# EAGLE schematic KVM Keyboard (EAGLE 9.6.2)
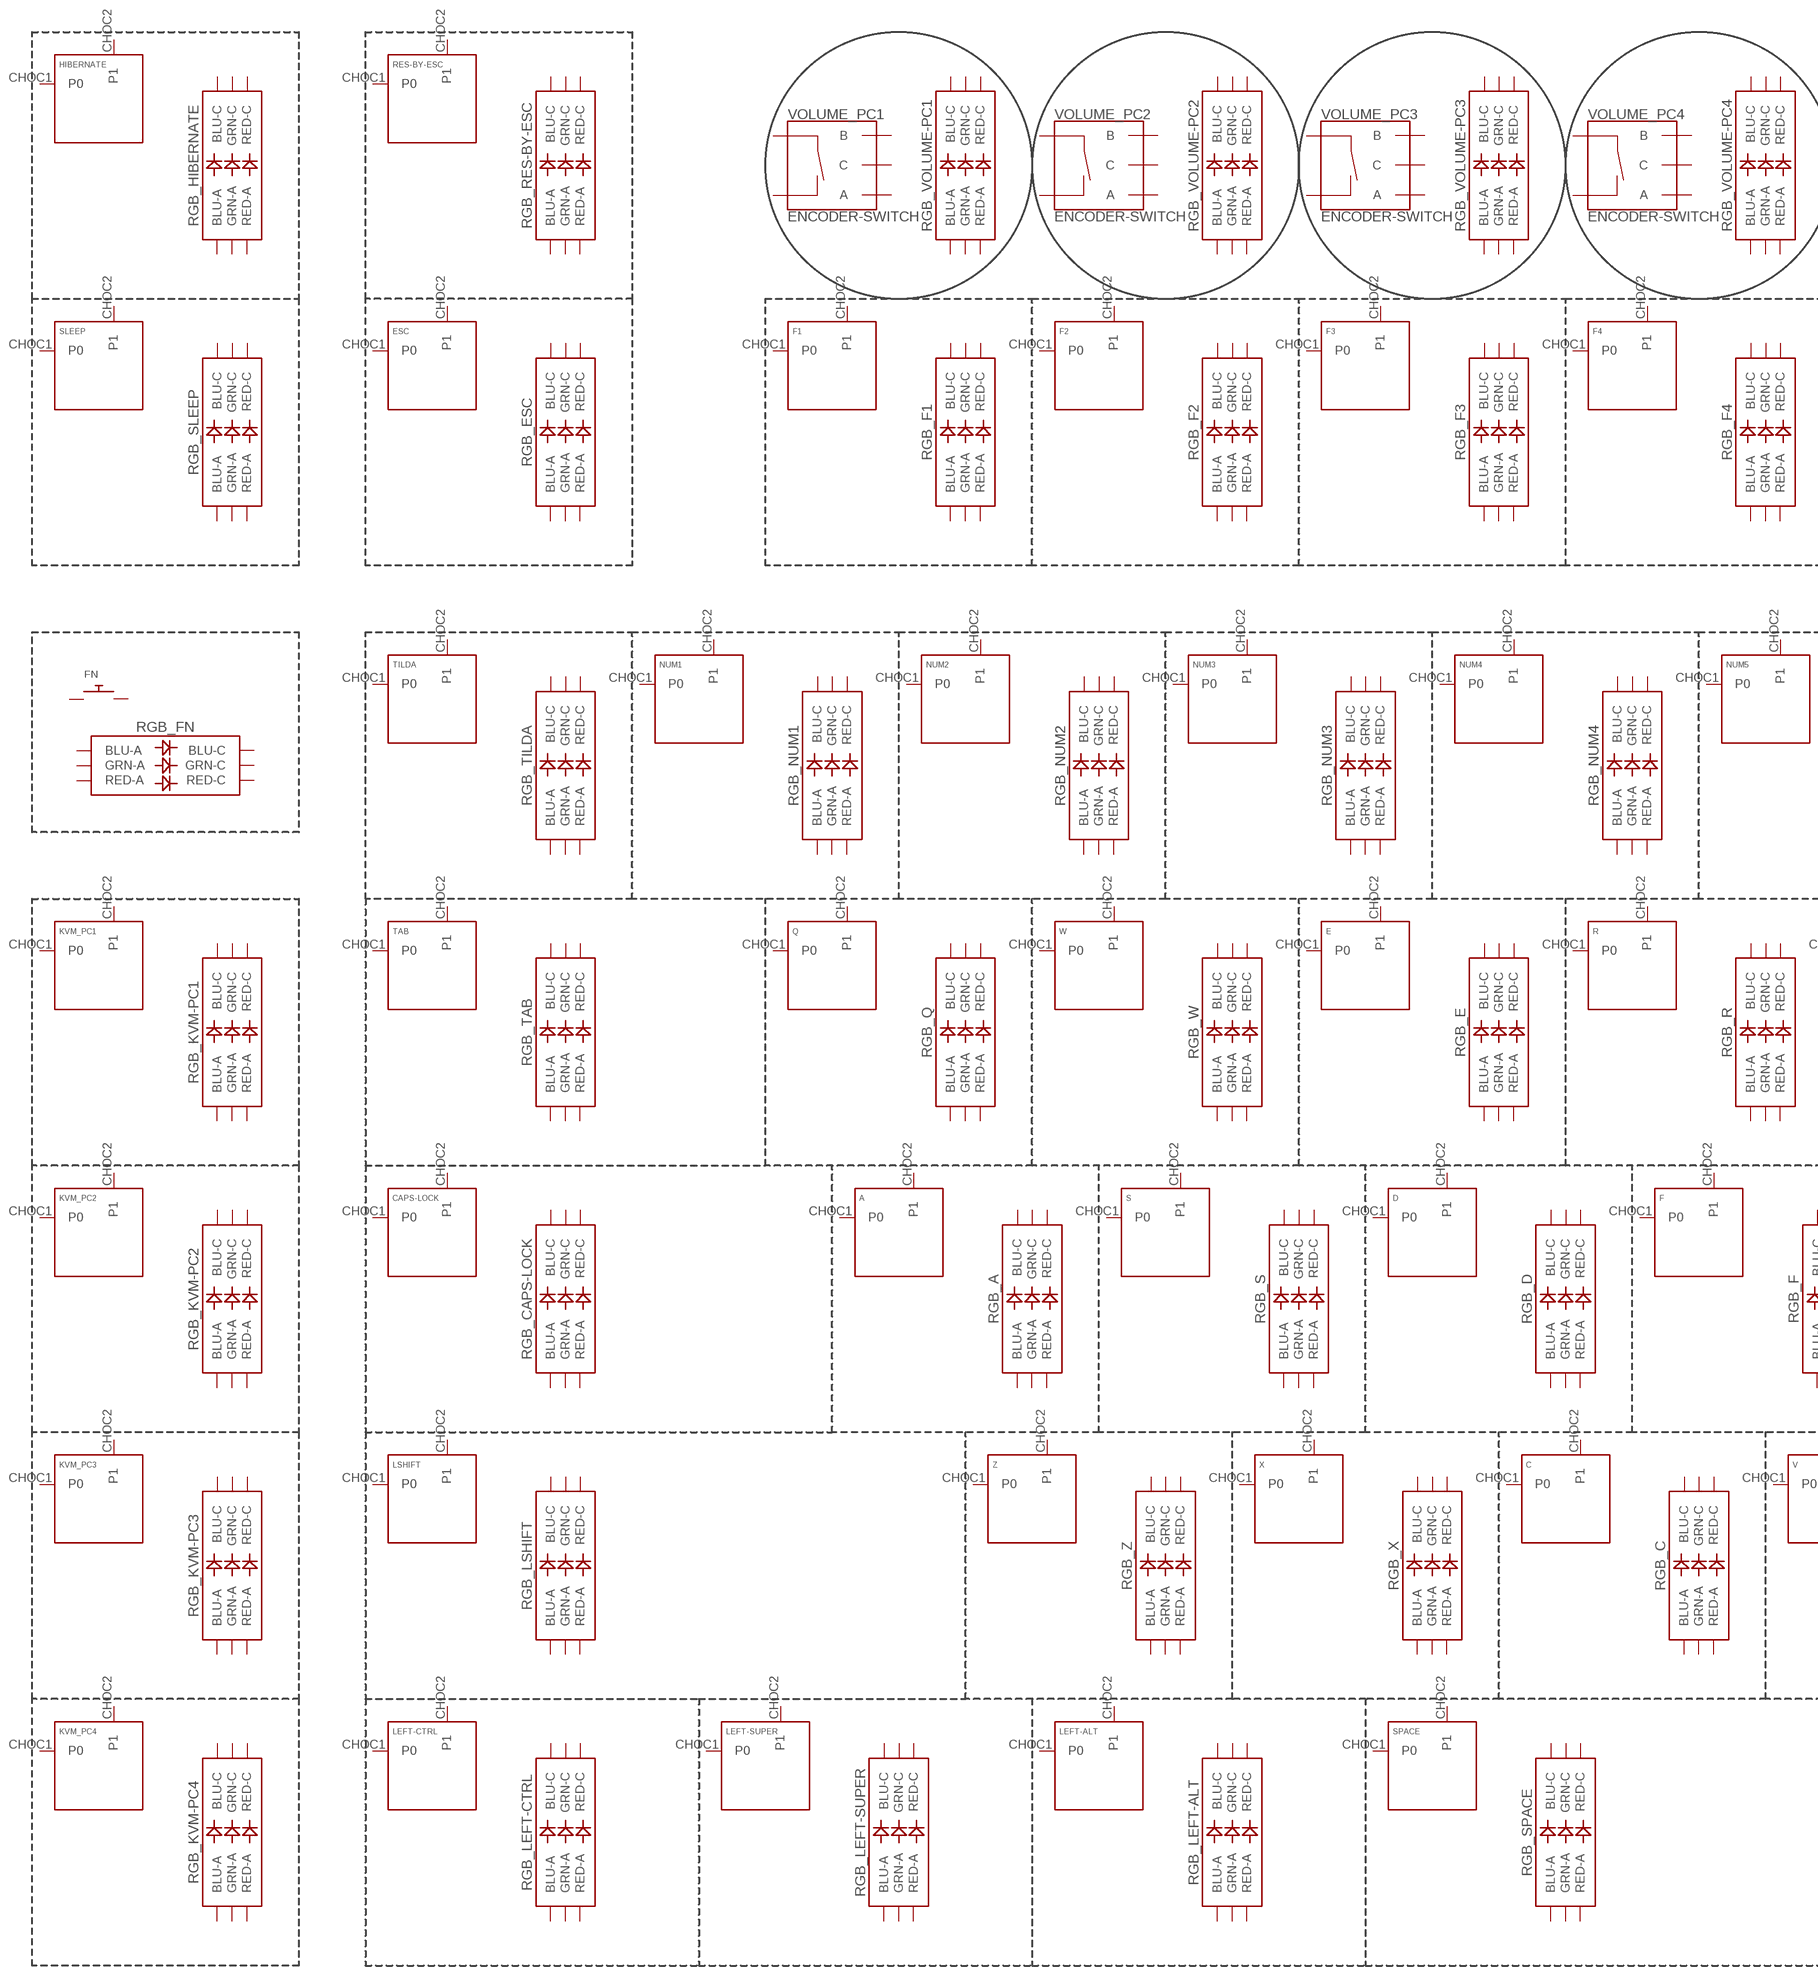
[diagram p0: schematic, sheet 1, part 1 of 3]
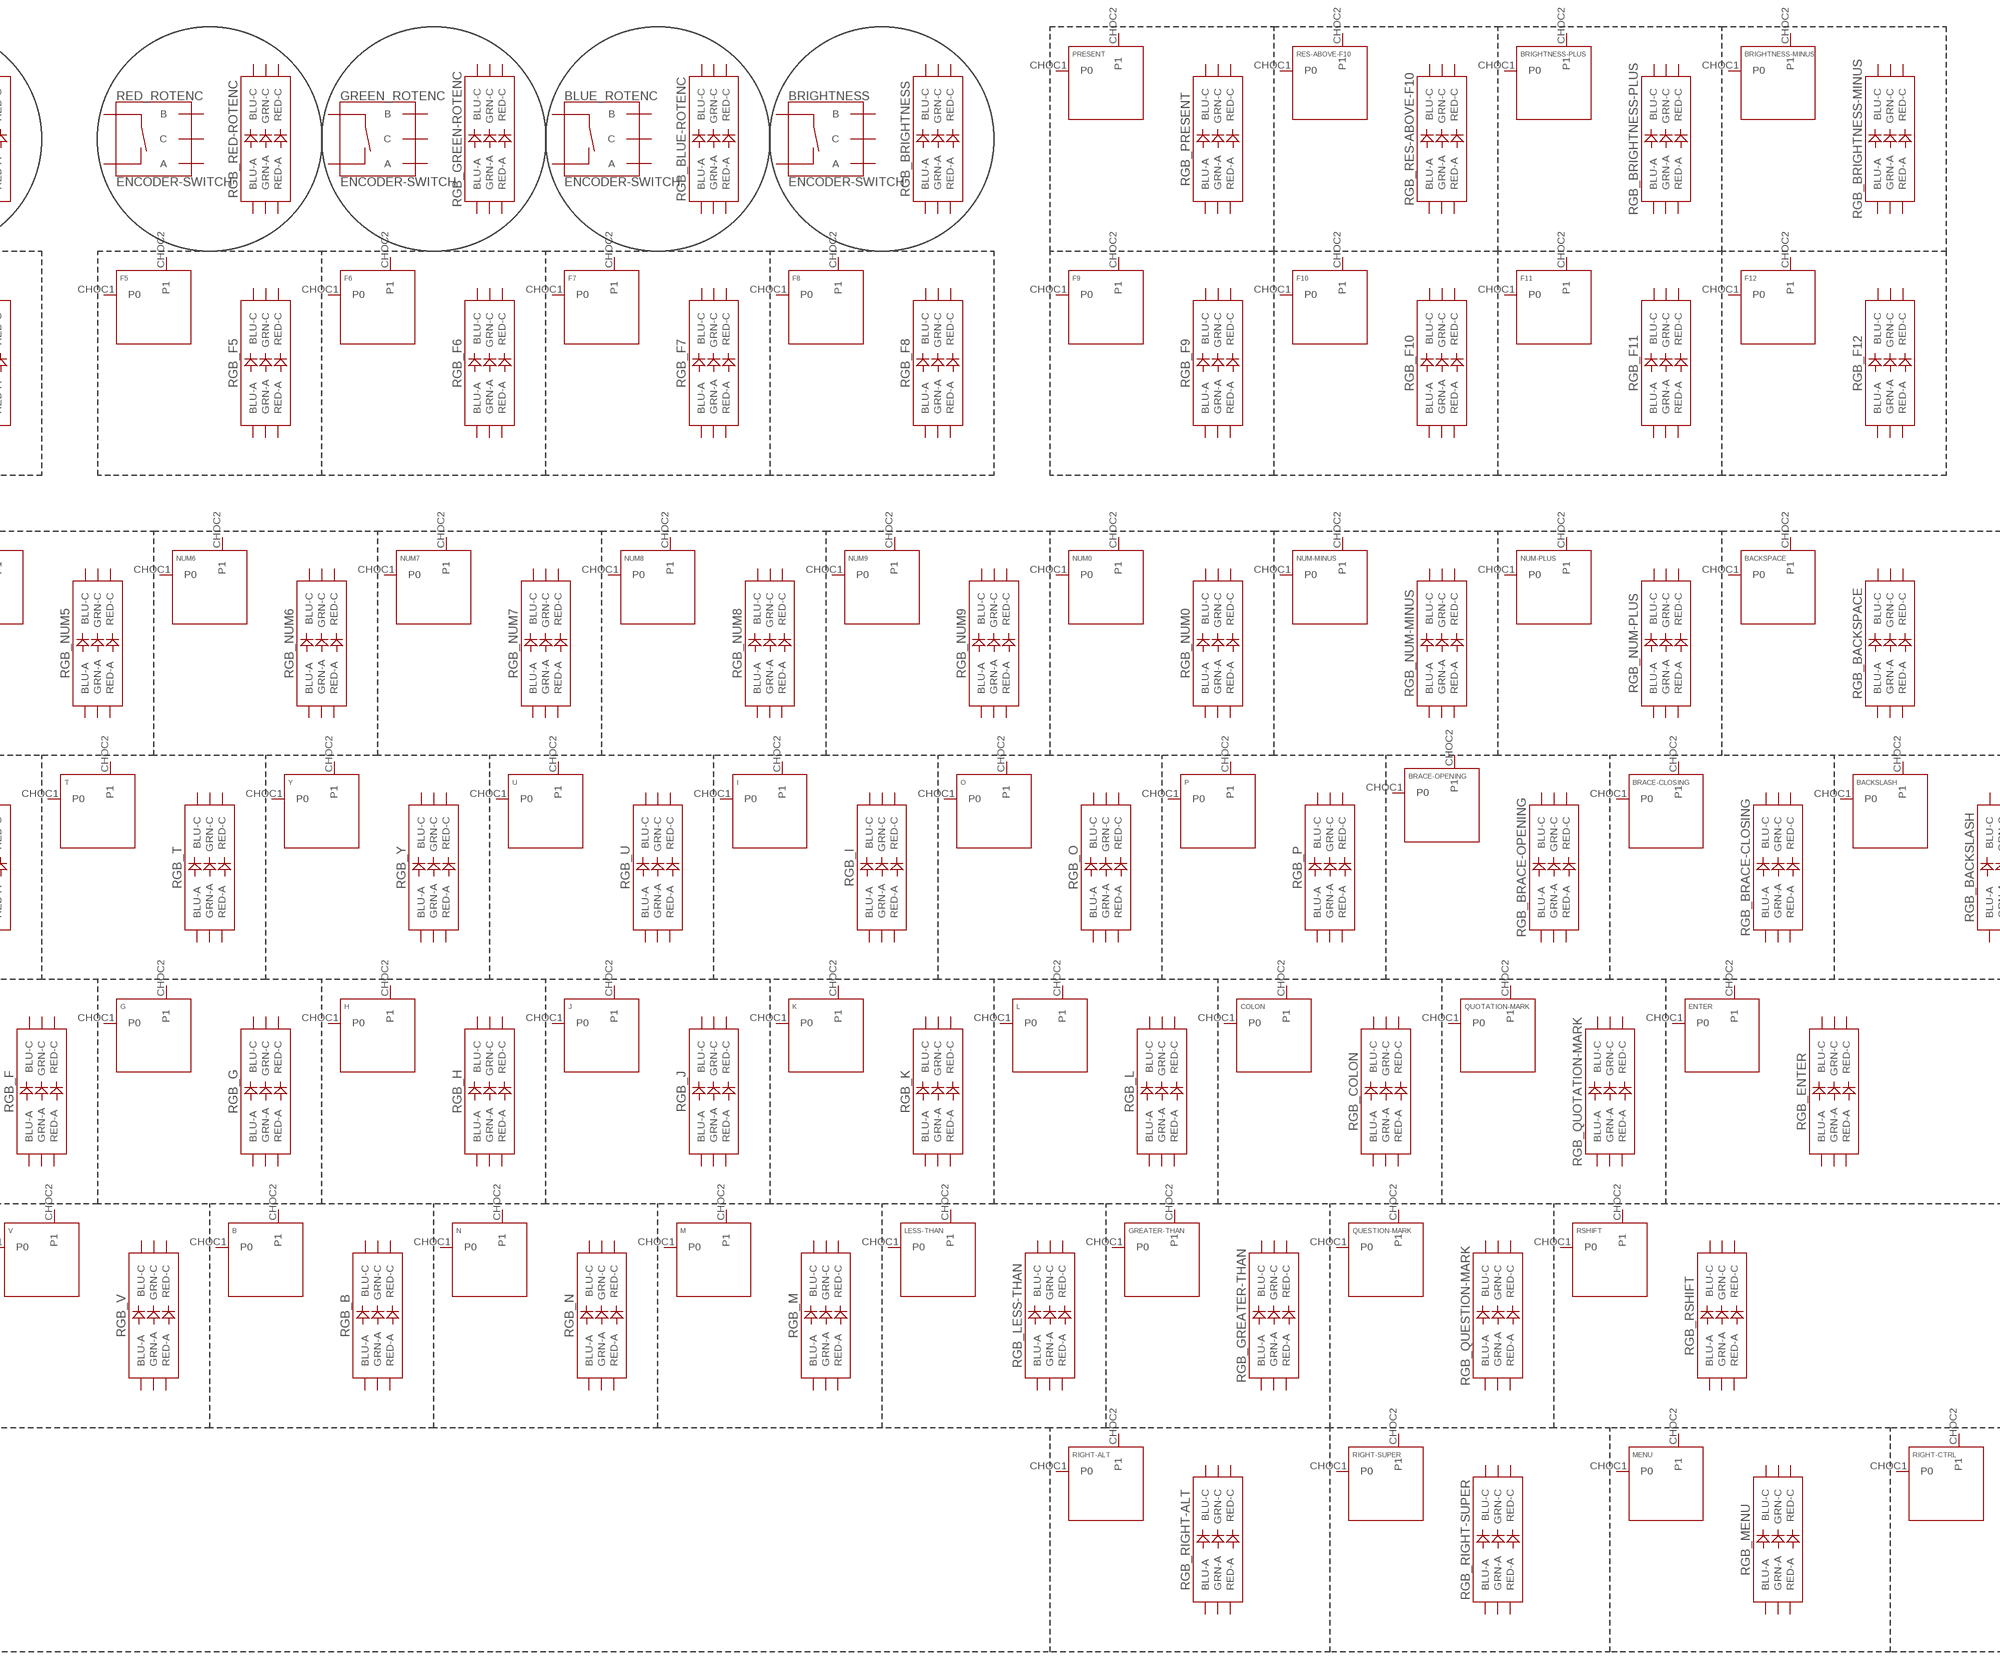
[diagram p1: schematic, sheet 1, part 2 of 3]
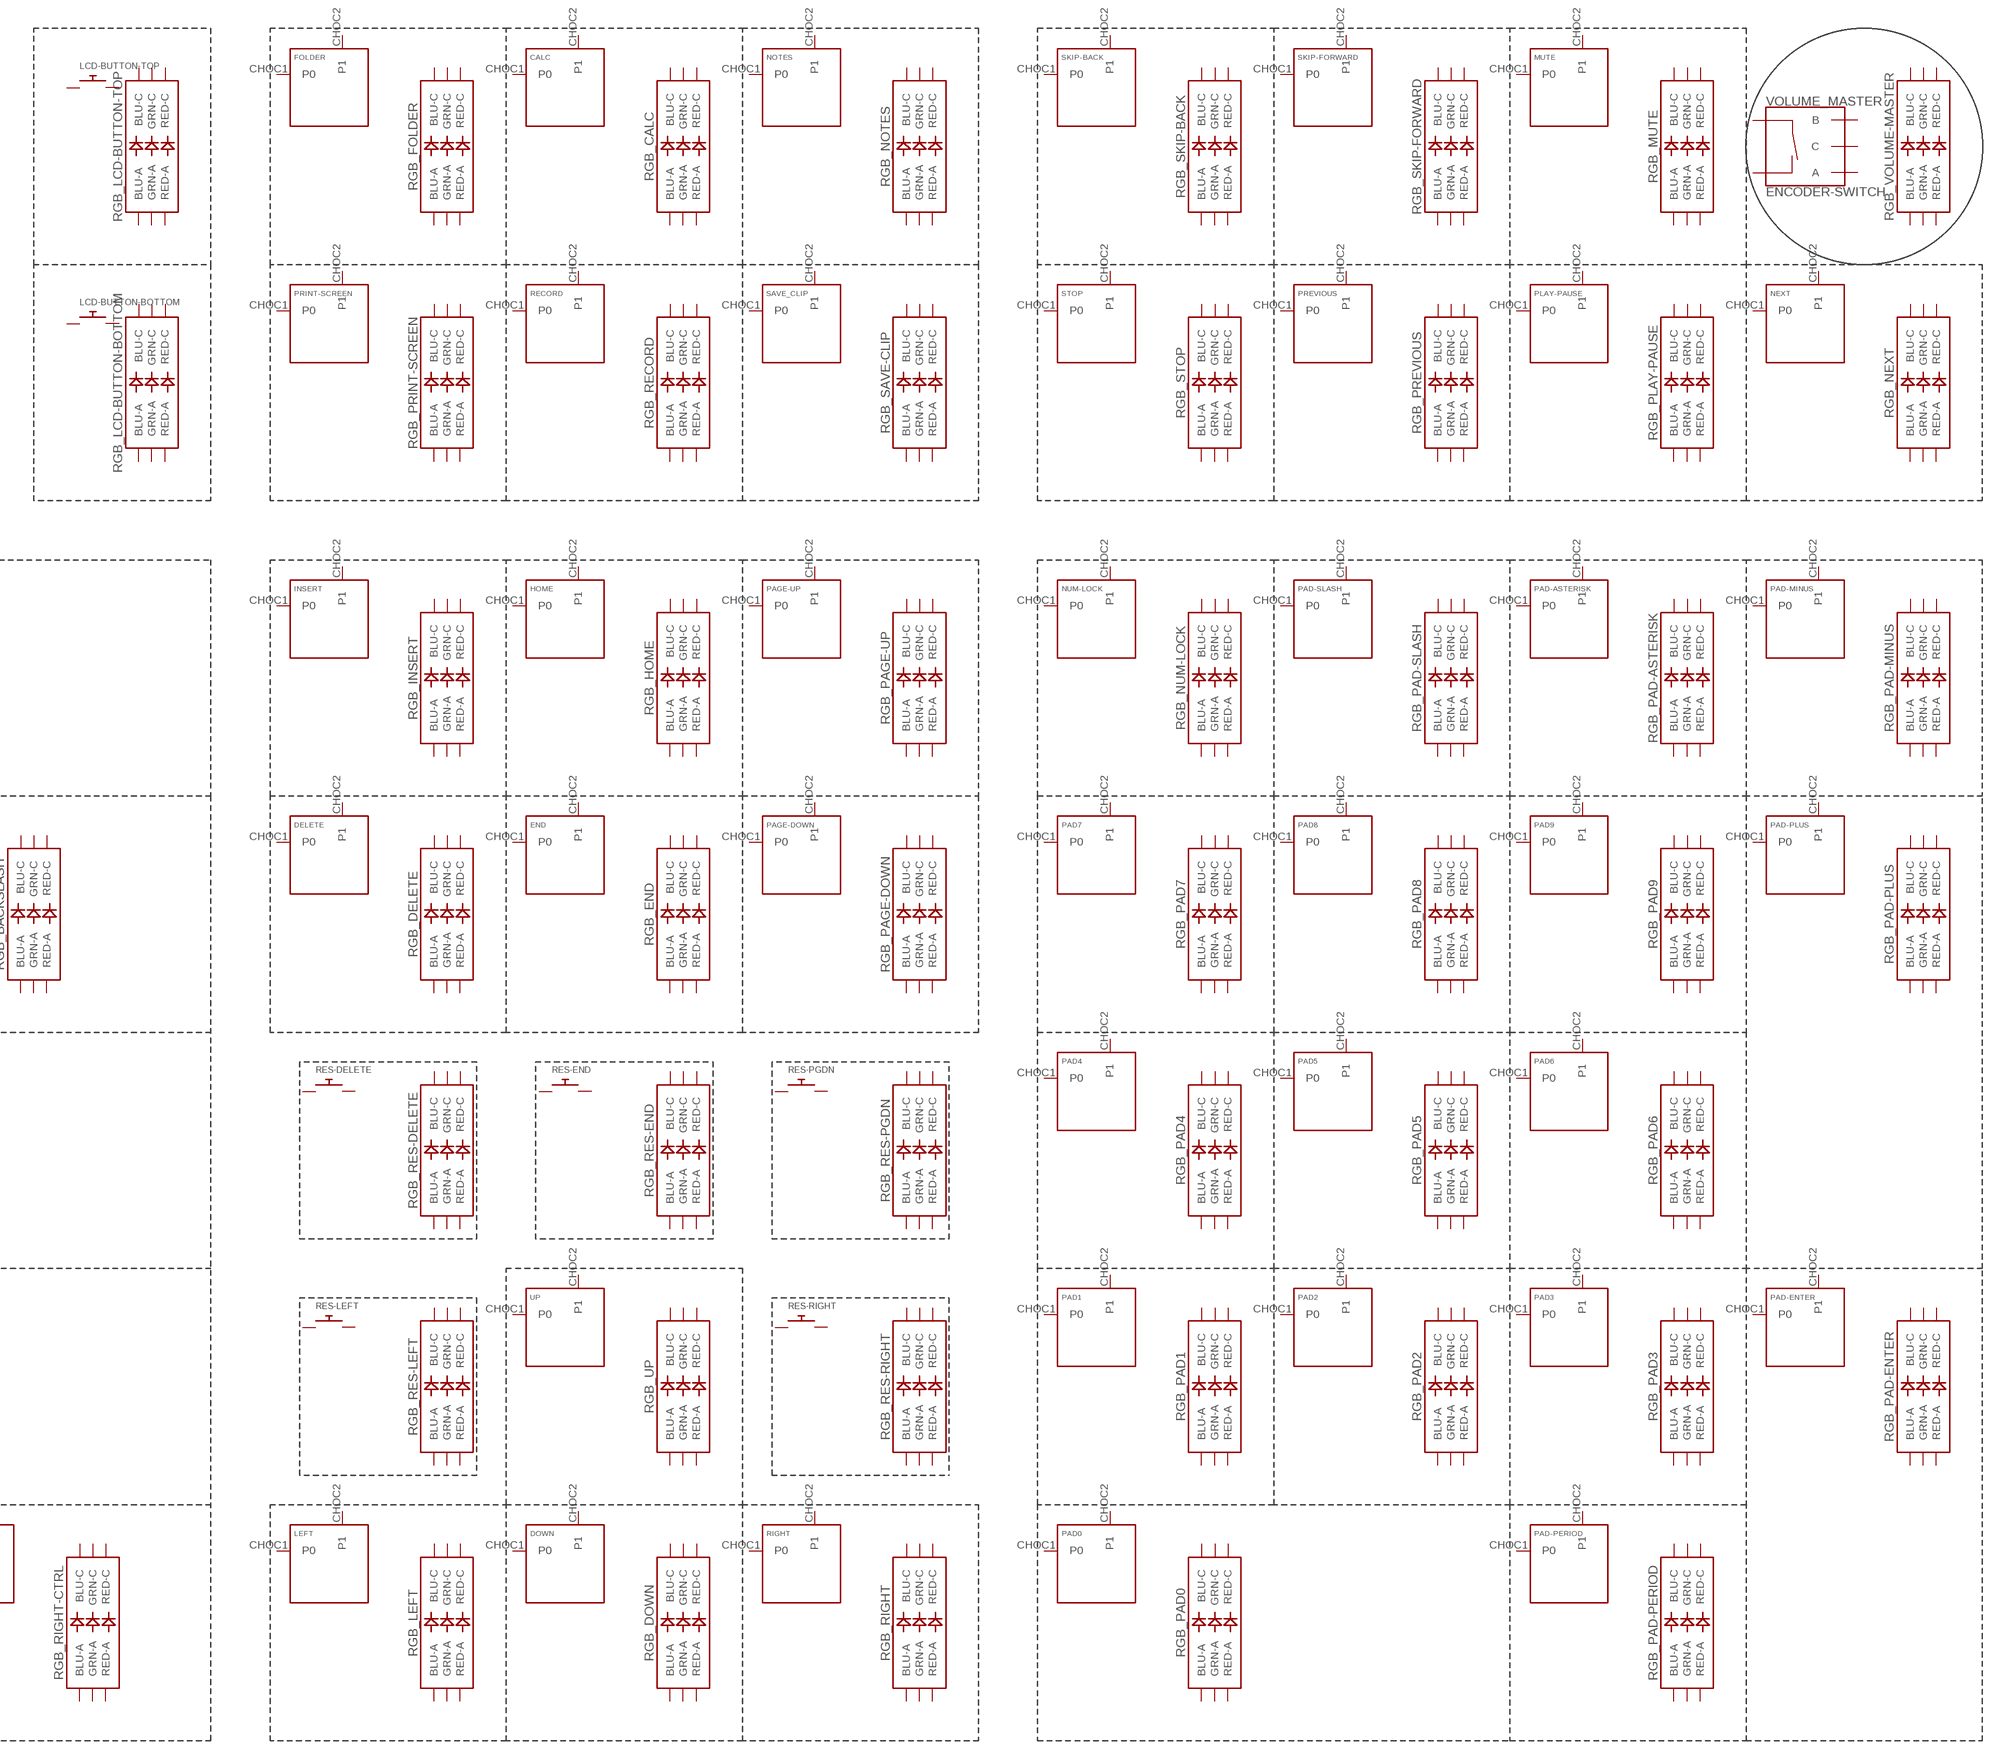
[diagram p2: schematic, sheet 1, part 3 of 3]

## Parts
A  KEYSWITCH-PLAIN-CHOC-1U  [CHOC-1U]
B  KEYSWITCH-PLAIN-CHOC-1U  [CHOC-1U]
BACKSLASH  KEYSWITCH-PLAIN-CHOC-1U  [CHOC-1U]
BACKSPACE  KEYSWITCH-PLAIN-CHOC-2U  [CHOC-2U]
BLUE_ROTENC  ENCODER-SWITCH  [ROTARY_ENC_PLAIN]
BRACE-CLOSING  KEYSWITCH-PLAIN-CHOC-1U  [CHOC-1U]
BRACE-OPENING  KEYSWITCH-PLAIN-CHOC-1U  [CHOC-1U]
BRIGHTNESS  ENCODER-SWITCH  [ROTARY_ENC_PLAIN]
BRIGHTNESS-MINUS  KEYSWITCH-PLAIN-CHOC-1U  [CHOC-1U]
BRIGHTNESS-PLUS  KEYSWITCH-PLAIN-CHOC-1U  [CHOC-1U]
C  KEYSWITCH-PLAIN-CHOC-1U  [CHOC-1U]
CALC  KEYSWITCH-PLAIN-CHOC-1U  [CHOC-1U]
CAPS-LOCK  KEYSWITCH-PLAIN-CHOC-1U  [CHOC-1U]
COLON  KEYSWITCH-PLAIN-CHOC-1U  [CHOC-1U]
D  KEYSWITCH-PLAIN-CHOC-1U  [CHOC-1U]
DELETE  KEYSWITCH-PLAIN-CHOC-1U  [CHOC-1U]
DOWN  KEYSWITCH-PLAIN-CHOC-1U  [CHOC-1U]
E  KEYSWITCH-PLAIN-CHOC-1U  [CHOC-1U]
END  KEYSWITCH-PLAIN-CHOC-1U  [CHOC-1U]
ENTER  KEYSWITCH-PLAIN-CHOC-2U  [CHOC-2U]
ESC  KEYSWITCH-PLAIN-CHOC-1U  [CHOC-1U]
F  KEYSWITCH-PLAIN-CHOC-1U  [CHOC-1U]
F1  KEYSWITCH-PLAIN-CHOC-1U  [CHOC-1U]
F2  KEYSWITCH-PLAIN-CHOC-1U  [CHOC-1U]
F3  KEYSWITCH-PLAIN-CHOC-1U  [CHOC-1U]
F4  KEYSWITCH-PLAIN-CHOC-1U  [CHOC-1U]
F5  KEYSWITCH-PLAIN-CHOC-1U  [CHOC-1U]
F6  KEYSWITCH-PLAIN-CHOC-1U  [CHOC-1U]
F7  KEYSWITCH-PLAIN-CHOC-1U  [CHOC-1U]
F8  KEYSWITCH-PLAIN-CHOC-1U  [CHOC-1U]
F9  KEYSWITCH-PLAIN-CHOC-1U  [CHOC-1U]
F10  KEYSWITCH-PLAIN-CHOC-1U  [CHOC-1U]
F11  KEYSWITCH-PLAIN-CHOC-1U  [CHOC-1U]
F12  KEYSWITCH-PLAIN-CHOC-1U  [CHOC-1U]
FN  SWITCH_PUSHBUTTONEVQ-PE  [TACT_PANA-EVQ]
FOLDER  KEYSWITCH-PLAIN-CHOC-1U  [CHOC-1U]
G  KEYSWITCH-PLAIN-CHOC-1U  [CHOC-1U]
GREATER-THAN  KEYSWITCH-PLAIN-CHOC-1U  [CHOC-1U]
GREEN_ROTENC  ENCODER-SWITCH  [ROTARY_ENC_PLAIN]
H  KEYSWITCH-PLAIN-CHOC-1U  [CHOC-1U]
HIBERNATE  KEYSWITCH-PLAIN-CHOC-1U  [CHOC-1U]
HOME  KEYSWITCH-PLAIN-CHOC-1U  [CHOC-1U]
I  KEYSWITCH-PLAIN-CHOC-1U  [CHOC-1U]
INSERT  KEYSWITCH-PLAIN-CHOC-1U  [CHOC-1U]
J  KEYSWITCH-PLAIN-CHOC-1U  [CHOC-1U]
K  KEYSWITCH-PLAIN-CHOC-1U  [CHOC-1U]
KVM_PC1  KEYSWITCH-PLAIN-CHOC-1U  [CHOC-1U]
KVM_PC2  KEYSWITCH-PLAIN-CHOC-1U  [CHOC-1U]
KVM_PC3  KEYSWITCH-PLAIN-CHOC-1U  [CHOC-1U]
KVM_PC4  KEYSWITCH-PLAIN-CHOC-1U  [CHOC-1U]
L  KEYSWITCH-PLAIN-CHOC-1U  [CHOC-1U]
LCD-BUTTON-BOTTOM  SWITCH_PUSHBUTTONEVQ-PE  [TACT_PANA-EVQ]
LCD-BUTTON-TOP  SWITCH_PUSHBUTTONEVQ-PE  [TACT_PANA-EVQ]
LEFT  KEYSWITCH-PLAIN-CHOC-1U  [CHOC-1U]
LEFT-ALT  KEYSWITCH-PLAIN-CHOC-1U  [CHOC-1U]
LEFT-CTRL  KEYSWITCH-PLAIN-CHOC-1U  [CHOC-1U]
LEFT-SUPER  KEYSWITCH-PLAIN-CHOC-1U  [CHOC-1U]
LESS-THAN  KEYSWITCH-PLAIN-CHOC-1U  [CHOC-1U]
LSHIFT  KEYSWITCH-PLAIN-CHOC-2U  [CHOC-2U]
M  KEYSWITCH-PLAIN-CHOC-1U  [CHOC-1U]
MENU  KEYSWITCH-PLAIN-CHOC-1U  [CHOC-1U]
MUTE  KEYSWITCH-PLAIN-CHOC-1U  [CHOC-1U]
N  KEYSWITCH-PLAIN-CHOC-1U  [CHOC-1U]
NEXT  KEYSWITCH-PLAIN-CHOC-1U  [CHOC-1U]
NOTES  KEYSWITCH-PLAIN-CHOC-1U  [CHOC-1U]
NUM0  KEYSWITCH-PLAIN-CHOC-1U  [CHOC-1U]
NUM1  KEYSWITCH-PLAIN-CHOC-1U  [CHOC-1U]
NUM2  KEYSWITCH-PLAIN-CHOC-1U  [CHOC-1U]
NUM3  KEYSWITCH-PLAIN-CHOC-1U  [CHOC-1U]
NUM4  KEYSWITCH-PLAIN-CHOC-1U  [CHOC-1U]
NUM5  KEYSWITCH-PLAIN-CHOC-1U  [CHOC-1U]
NUM6  KEYSWITCH-PLAIN-CHOC-1U  [CHOC-1U]
NUM7  KEYSWITCH-PLAIN-CHOC-1U  [CHOC-1U]
NUM8  KEYSWITCH-PLAIN-CHOC-1U  [CHOC-1U]
NUM9  KEYSWITCH-PLAIN-CHOC-1U  [CHOC-1U]
NUM-LOCK  KEYSWITCH-PLAIN-CHOC-1U  [CHOC-1U]
NUM-MINUS  KEYSWITCH-PLAIN-CHOC-1U  [CHOC-1U]
NUM-PLUS  KEYSWITCH-PLAIN-CHOC-1U  [CHOC-1U]
O  KEYSWITCH-PLAIN-CHOC-1U  [CHOC-1U]
P  KEYSWITCH-PLAIN-CHOC-1U  [CHOC-1U]
PAD0  KEYSWITCH-PLAIN-CHOC-2U  [CHOC-2U]
PAD1  KEYSWITCH-PLAIN-CHOC-1U  [CHOC-1U]
PAD2  KEYSWITCH-PLAIN-CHOC-1U  [CHOC-1U]
PAD3  KEYSWITCH-PLAIN-CHOC-1U  [CHOC-1U]
PAD4  KEYSWITCH-PLAIN-CHOC-1U  [CHOC-1U]
PAD5  KEYSWITCH-PLAIN-CHOC-1U  [CHOC-1U]
PAD6  KEYSWITCH-PLAIN-CHOC-1U  [CHOC-1U]
PAD7  KEYSWITCH-PLAIN-CHOC-1U  [CHOC-1U]
PAD8  KEYSWITCH-PLAIN-CHOC-1U  [CHOC-1U]
PAD9  KEYSWITCH-PLAIN-CHOC-1U  [CHOC-1U]
PAD-ASTERISK  KEYSWITCH-PLAIN-CHOC-1U  [CHOC-1U]
PAD-ENTER  KEYSWITCH-PLAIN-CHOC-2U  [CHOC-2U]
PAD-MINUS  KEYSWITCH-PLAIN-CHOC-1U  [CHOC-1U]
PAD-PERIOD  KEYSWITCH-PLAIN-CHOC-1U  [CHOC-1U]
PAD-PLUS  KEYSWITCH-PLAIN-CHOC-2U  [CHOC-2U]
PAD-SLASH  KEYSWITCH-PLAIN-CHOC-1U  [CHOC-1U]
PAGE-DOWN  KEYSWITCH-PLAIN-CHOC-1U  [CHOC-1U]
PAGE-UP  KEYSWITCH-PLAIN-CHOC-1U  [CHOC-1U]
PLAY-PAUSE  KEYSWITCH-PLAIN-CHOC-1U  [CHOC-1U]
PRESENT  KEYSWITCH-PLAIN-CHOC-1U  [CHOC-1U]
PREVIOUS  KEYSWITCH-PLAIN-CHOC-1U  [CHOC-1U]
PRINT-SCREEN  KEYSWITCH-PLAIN-CHOC-1U  [CHOC-1U]
Q  KEYSWITCH-PLAIN-CHOC-1U  [CHOC-1U]
QUESTION-MARK  KEYSWITCH-PLAIN-CHOC-1U  [CHOC-1U]
QUOTATION-MARK  KEYSWITCH-PLAIN-CHOC-1U  [CHOC-1U]
R  KEYSWITCH-PLAIN-CHOC-1U  [CHOC-1U]
RECORD  KEYSWITCH-PLAIN-CHOC-1U  [CHOC-1U]
RED_ROTENC  ENCODER-SWITCH  [ROTARY_ENC_PLAIN]
RES-ABOVE-F10  KEYSWITCH-PLAIN-CHOC-1U  [CHOC-1U]
RES-BY-ESC  KEYSWITCH-PLAIN-CHOC-1U  [CHOC-1U]
RES-DELETE  SWITCH_PUSHBUTTONEVQ-PE  [TACT_PANA-EVQ]
RES-END  SWITCH_PUSHBUTTONEVQ-PE  [TACT_PANA-EVQ]
RES-LEFT  SWITCH_PUSHBUTTONEVQ-PE  [TACT_PANA-EVQ]
RES-PGDN  SWITCH_PUSHBUTTONEVQ-PE  [TACT_PANA-EVQ]
RES-RIGHT  SWITCH_PUSHBUTTONEVQ-PE  [TACT_PANA-EVQ]
RGB_A  LED-RGBNO_IC  [LED-TRICOLOR-5050]
RGB_B  LED-RGBNO_IC  [LED-TRICOLOR-5050]
RGB_BACKSLASH  LED-RGBNO_IC  [LED-TRICOLOR-5050]
RGB_BACKSPACE  LED-RGBNO_IC  [LED-TRICOLOR-5050]
RGB_BLUE-ROTENC  LED-RGBNO_IC  [LED-TRICOLOR-5050]
RGB_BRACE-CLOSING  LED-RGBNO_IC  [LED-TRICOLOR-5050]
RGB_BRACE-OPENING  LED-RGBNO_IC  [LED-TRICOLOR-5050]
RGB_BRIGHTNESS  LED-RGBNO_IC  [LED-TRICOLOR-5050]
RGB_BRIGHTNESS-MINUS  LED-RGBNO_IC  [LED-TRICOLOR-5050]
RGB_BRIGHTNESS-PLUS  LED-RGBNO_IC  [LED-TRICOLOR-5050]
RGB_C  LED-RGBNO_IC  [LED-TRICOLOR-5050]
RGB_CALC  LED-RGBNO_IC  [LED-TRICOLOR-5050]
RGB_CAPS-LOCK  LED-RGBNO_IC  [LED-TRICOLOR-5050]
RGB_COLON  LED-RGBNO_IC  [LED-TRICOLOR-5050]
RGB_D  LED-RGBNO_IC  [LED-TRICOLOR-5050]
RGB_DELETE  LED-RGBNO_IC  [LED-TRICOLOR-5050]
RGB_DOWN  LED-RGBNO_IC  [LED-TRICOLOR-5050]
RGB_E  LED-RGBNO_IC  [LED-TRICOLOR-5050]
RGB_END  LED-RGBNO_IC  [LED-TRICOLOR-5050]
RGB_ENTER  LED-RGBNO_IC  [LED-TRICOLOR-5050]
RGB_ESC  LED-RGBNO_IC  [LED-TRICOLOR-5050]
RGB_F  LED-RGBNO_IC  [LED-TRICOLOR-5050]
RGB_F1  LED-RGBNO_IC  [LED-TRICOLOR-5050]
RGB_F2  LED-RGBNO_IC  [LED-TRICOLOR-5050]
RGB_F3  LED-RGBNO_IC  [LED-TRICOLOR-5050]
RGB_F4  LED-RGBNO_IC  [LED-TRICOLOR-5050]
RGB_F5  LED-RGBNO_IC  [LED-TRICOLOR-5050]
RGB_F6  LED-RGBNO_IC  [LED-TRICOLOR-5050]
RGB_F7  LED-RGBNO_IC  [LED-TRICOLOR-5050]
RGB_F8  LED-RGBNO_IC  [LED-TRICOLOR-5050]
RGB_F9  LED-RGBNO_IC  [LED-TRICOLOR-5050]
RGB_F10  LED-RGBNO_IC  [LED-TRICOLOR-5050]
RGB_F11  LED-RGBNO_IC  [LED-TRICOLOR-5050]
RGB_F12  LED-RGBNO_IC  [LED-TRICOLOR-5050]
RGB_FN  LED-RGBNO_IC  [LED-TRICOLOR-5050]
RGB_FOLDER  LED-RGBNO_IC  [LED-TRICOLOR-5050]
RGB_G  LED-RGBNO_IC  [LED-TRICOLOR-5050]
RGB_GREATER-THAN  LED-RGBNO_IC  [LED-TRICOLOR-5050]
RGB_GREEN-ROTENC  LED-RGBNO_IC  [LED-TRICOLOR-5050]
RGB_H  LED-RGBNO_IC  [LED-TRICOLOR-5050]
RGB_HIBERNATE  LED-RGBNO_IC  [LED-TRICOLOR-5050]
RGB_HOME  LED-RGBNO_IC  [LED-TRICOLOR-5050]
RGB_I  LED-RGBNO_IC  [LED-TRICOLOR-5050]
RGB_INSERT  LED-RGBNO_IC  [LED-TRICOLOR-5050]
RGB_J  LED-RGBNO_IC  [LED-TRICOLOR-5050]
RGB_K  LED-RGBNO_IC  [LED-TRICOLOR-5050]
RGB_KVM-PC1  LED-RGBNO_IC  [LED-TRICOLOR-5050]
RGB_KVM-PC2  LED-RGBNO_IC  [LED-TRICOLOR-5050]
RGB_KVM-PC3  LED-RGBNO_IC  [LED-TRICOLOR-5050]
RGB_KVM-PC4  LED-RGBNO_IC  [LED-TRICOLOR-5050]
RGB_L  LED-RGBNO_IC  [LED-TRICOLOR-5050]
RGB_LCD-BUTTON-BOTTOM  LED-RGBNO_IC  [LED-TRICOLOR-5050]
RGB_LCD-BUTTON-TOP  LED-RGBNO_IC  [LED-TRICOLOR-5050]
RGB_LEFT  LED-RGBNO_IC  [LED-TRICOLOR-5050]
RGB_LEFT-ALT  LED-RGBNO_IC  [LED-TRICOLOR-5050]
RGB_LEFT-CTRL  LED-RGBNO_IC  [LED-TRICOLOR-5050]
RGB_LEFT-SUPER  LED-RGBNO_IC  [LED-TRICOLOR-5050]
RGB_LESS-THAN  LED-RGBNO_IC  [LED-TRICOLOR-5050]
RGB_LSHIFT  LED-RGBNO_IC  [LED-TRICOLOR-5050]
RGB_M  LED-RGBNO_IC  [LED-TRICOLOR-5050]
RGB_MENU  LED-RGBNO_IC  [LED-TRICOLOR-5050]
RGB_MUTE  LED-RGBNO_IC  [LED-TRICOLOR-5050]
RGB_N  LED-RGBNO_IC  [LED-TRICOLOR-5050]
RGB_NEXT  LED-RGBNO_IC  [LED-TRICOLOR-5050]
RGB_NOTES  LED-RGBNO_IC  [LED-TRICOLOR-5050]
RGB_NUM0  LED-RGBNO_IC  [LED-TRICOLOR-5050]
RGB_NUM1  LED-RGBNO_IC  [LED-TRICOLOR-5050]
RGB_NUM2  LED-RGBNO_IC  [LED-TRICOLOR-5050]
RGB_NUM3  LED-RGBNO_IC  [LED-TRICOLOR-5050]
RGB_NUM4  LED-RGBNO_IC  [LED-TRICOLOR-5050]
RGB_NUM5  LED-RGBNO_IC  [LED-TRICOLOR-5050]
RGB_NUM6  LED-RGBNO_IC  [LED-TRICOLOR-5050]
RGB_NUM7  LED-RGBNO_IC  [LED-TRICOLOR-5050]
RGB_NUM8  LED-RGBNO_IC  [LED-TRICOLOR-5050]
RGB_NUM9  LED-RGBNO_IC  [LED-TRICOLOR-5050]
RGB_NUM-LOCK  LED-RGBNO_IC  [LED-TRICOLOR-5050]
RGB_NUM-MINUS  LED-RGBNO_IC  [LED-TRICOLOR-5050]
RGB_NUM-PLUS  LED-RGBNO_IC  [LED-TRICOLOR-5050]
RGB_O  LED-RGBNO_IC  [LED-TRICOLOR-5050]
RGB_P  LED-RGBNO_IC  [LED-TRICOLOR-5050]
RGB_PAD0  LED-RGBNO_IC  [LED-TRICOLOR-5050]
RGB_PAD1  LED-RGBNO_IC  [LED-TRICOLOR-5050]
RGB_PAD2  LED-RGBNO_IC  [LED-TRICOLOR-5050]
RGB_PAD3  LED-RGBNO_IC  [LED-TRICOLOR-5050]
RGB_PAD4  LED-RGBNO_IC  [LED-TRICOLOR-5050]
RGB_PAD5  LED-RGBNO_IC  [LED-TRICOLOR-5050]
RGB_PAD6  LED-RGBNO_IC  [LED-TRICOLOR-5050]
RGB_PAD7  LED-RGBNO_IC  [LED-TRICOLOR-5050]
RGB_PAD8  LED-RGBNO_IC  [LED-TRICOLOR-5050]
RGB_PAD9  LED-RGBNO_IC  [LED-TRICOLOR-5050]
RGB_PAD-ASTERISK  LED-RGBNO_IC  [LED-TRICOLOR-5050]
RGB_PAD-ENTER  LED-RGBNO_IC  [LED-TRICOLOR-5050]
RGB_PAD-MINUS  LED-RGBNO_IC  [LED-TRICOLOR-5050]
RGB_PAD-PERIOD  LED-RGBNO_IC  [LED-TRICOLOR-5050]
RGB_PAD-PLUS  LED-RGBNO_IC  [LED-TRICOLOR-5050]
RGB_PAD-SLASH  LED-RGBNO_IC  [LED-TRICOLOR-5050]
RGB_PAGE-DOWN  LED-RGBNO_IC  [LED-TRICOLOR-5050]
RGB_PAGE-UP  LED-RGBNO_IC  [LED-TRICOLOR-5050]
RGB_PLAY-PAUSE  LED-RGBNO_IC  [LED-TRICOLOR-5050]
RGB_PRESENT  LED-RGBNO_IC  [LED-TRICOLOR-5050]
RGB_PREVIOUS  LED-RGBNO_IC  [LED-TRICOLOR-5050]
RGB_PRINT-SCREEN  LED-RGBNO_IC  [LED-TRICOLOR-5050]
RGB_Q  LED-RGBNO_IC  [LED-TRICOLOR-5050]
RGB_QUESTION-MARK  LED-RGBNO_IC  [LED-TRICOLOR-5050]
RGB_QUOTATION-MARK  LED-RGBNO_IC  [LED-TRICOLOR-5050]
RGB_R  LED-RGBNO_IC  [LED-TRICOLOR-5050]
RGB_RECORD  LED-RGBNO_IC  [LED-TRICOLOR-5050]
RGB_RED-ROTENC  LED-RGBNO_IC  [LED-TRICOLOR-5050]
RGB_RES-ABOVE-F10  LED-RGBNO_IC  [LED-TRICOLOR-5050]
RGB_RES-BY-ESC  LED-RGBNO_IC  [LED-TRICOLOR-5050]
RGB_RES-DELETE  LED-RGBNO_IC  [LED-TRICOLOR-5050]
RGB_RES-END  LED-RGBNO_IC  [LED-TRICOLOR-5050]
RGB_RES-LEFT  LED-RGBNO_IC  [LED-TRICOLOR-5050]
RGB_RES-PGDN  LED-RGBNO_IC  [LED-TRICOLOR-5050]
RGB_RES-RIGHT  LED-RGBNO_IC  [LED-TRICOLOR-5050]
RGB_RIGHT  LED-RGBNO_IC  [LED-TRICOLOR-5050]
RGB_RIGHT-ALT  LED-RGBNO_IC  [LED-TRICOLOR-5050]
RGB_RIGHT-CTRL  LED-RGBNO_IC  [LED-TRICOLOR-5050]
RGB_RIGHT-SUPER  LED-RGBNO_IC  [LED-TRICOLOR-5050]
RGB_RSHIFT  LED-RGBNO_IC  [LED-TRICOLOR-5050]
RGB_S  LED-RGBNO_IC  [LED-TRICOLOR-5050]
RGB_SAVE-CLIP  LED-RGBNO_IC  [LED-TRICOLOR-5050]
RGB_SKIP-BACK  LED-RGBNO_IC  [LED-TRICOLOR-5050]
RGB_SKIP-FORWARD  LED-RGBNO_IC  [LED-TRICOLOR-5050]
RGB_SLEEP  LED-RGBNO_IC  [LED-TRICOLOR-5050]
RGB_SPACE  LED-RGBNO_IC  [LED-TRICOLOR-5050]
RGB_STOP  LED-RGBNO_IC  [LED-TRICOLOR-5050]
RGB_T  LED-RGBNO_IC  [LED-TRICOLOR-5050]
RGB_TAB  LED-RGBNO_IC  [LED-TRICOLOR-5050]
RGB_TILDA  LED-RGBNO_IC  [LED-TRICOLOR-5050]
RGB_U  LED-RGBNO_IC  [LED-TRICOLOR-5050]
RGB_UP  LED-RGBNO_IC  [LED-TRICOLOR-5050]
RGB_V  LED-RGBNO_IC  [LED-TRICOLOR-5050]
RGB_VOLUME-MASTER  LED-RGBNO_IC  [LED-TRICOLOR-5050]
RGB_VOLUME-PC1  LED-RGBNO_IC  [LED-TRICOLOR-5050]
RGB_VOLUME-PC2  LED-RGBNO_IC  [LED-TRICOLOR-5050]
RGB_VOLUME-PC3  LED-RGBNO_IC  [LED-TRICOLOR-5050]
RGB_VOLUME-PC4  LED-RGBNO_IC  [LED-TRICOLOR-5050]
RGB_W  LED-RGBNO_IC  [LED-TRICOLOR-5050]
RGB_X  LED-RGBNO_IC  [LED-TRICOLOR-5050]
RGB_Y  LED-RGBNO_IC  [LED-TRICOLOR-5050]
RGB_Z  LED-RGBNO_IC  [LED-TRICOLOR-5050]
RIGHT  KEYSWITCH-PLAIN-CHOC-1U  [CHOC-1U]
RIGHT-ALT  KEYSWITCH-PLAIN-CHOC-1U  [CHOC-1U]
RIGHT-CTRL  KEYSWITCH-PLAIN-CHOC-1U  [CHOC-1U]
RIGHT-SUPER  KEYSWITCH-PLAIN-CHOC-1U  [CHOC-1U]
RSHIFT  KEYSWITCH-PLAIN-CHOC-2U  [CHOC-2U]
S  KEYSWITCH-PLAIN-CHOC-1U  [CHOC-1U]
SAVE_CLIP  KEYSWITCH-PLAIN-CHOC-1U  [CHOC-1U]
SKIP-BACK  KEYSWITCH-PLAIN-CHOC-1U  [CHOC-1U]
SKIP-FORWARD  KEYSWITCH-PLAIN-CHOC-1U  [CHOC-1U]
SLEEP  KEYSWITCH-PLAIN-CHOC-1U  [CHOC-1U]
SPACE  KEYSWITCH-PLAIN-CHOC-6.25U  [CHOC-6.25U]
STOP  KEYSWITCH-PLAIN-CHOC-1U  [CHOC-1U]
T  KEYSWITCH-PLAIN-CHOC-1U  [CHOC-1U]
TAB  KEYSWITCH-PLAIN-CHOC-1U  [CHOC-1U]
TILDA  KEYSWITCH-PLAIN-CHOC-1U  [CHOC-1U]
U  KEYSWITCH-PLAIN-CHOC-1U  [CHOC-1U]
UP  KEYSWITCH-PLAIN-CHOC-1U  [CHOC-1U]
V  KEYSWITCH-PLAIN-CHOC-1U  [CHOC-1U]
VOLUME_MASTER  ENCODER-SWITCH  [ROTARY_ENC_PLAIN]
VOLUME_PC1  ENCODER-SWITCH  [ROTARY_ENC_PLAIN]
VOLUME_PC2  ENCODER-SWITCH  [ROTARY_ENC_PLAIN]
VOLUME_PC3  ENCODER-SWITCH  [ROTARY_ENC_PLAIN]
VOLUME_PC4  ENCODER-SWITCH  [ROTARY_ENC_PLAIN]
W  KEYSWITCH-PLAIN-CHOC-1U  [CHOC-1U]
X  KEYSWITCH-PLAIN-CHOC-1U  [CHOC-1U]
Y  KEYSWITCH-PLAIN-CHOC-1U  [CHOC-1U]
Z  KEYSWITCH-PLAIN-CHOC-1U  [CHOC-1U]
Unconnected: A.CHOC1(P0) A.CHOC2(P1) B.CHOC1(P0) B.CHOC2(P1) BACKSLASH.CHOC1(P0) BACKSLASH.CHOC2(P1) BACKSPACE.CHOC1(P0) BACKSPACE.CHOC2(P1) BLUE_ROTENC.A BLUE_ROTENC.B BLUE_ROTENC.C BLUE_ROTENC.SW+ BLUE_ROTENC.SW- BRACE-CLOSING.CHOC1(P0) BRACE-CLOSING.CHOC2(P1) BRACE-OPENING.CHOC1(P0) BRACE-OPENING.CHOC2(P1) BRIGHTNESS-MINUS.CHOC1(P0) BRIGHTNESS-MINUS.CHOC2(P1) BRIGHTNESS-PLUS.CHOC1(P0) BRIGHTNESS-PLUS.CHOC2(P1) BRIGHTNESS.A BRIGHTNESS.B BRIGHTNESS.C BRIGHTNESS.SW+ BRIGHTNESS.SW- C.CHOC1(P0) C.CHOC2(P1) CALC.CHOC1(P0) CALC.CHOC2(P1) CAPS-LOCK.CHOC1(P0) CAPS-LOCK.CHOC2(P1) COLON.CHOC1(P0) COLON.CHOC2(P1) D.CHOC1(P0) D.CHOC2(P1) DELETE.CHOC1(P0) DELETE.CHOC2(P1) DOWN.CHOC1(P0) DOWN.CHOC2(P1) E.CHOC1(P0) E.CHOC2(P1) END.CHOC1(P0) END.CHOC2(P1) ENTER.CHOC1(P0) ENTER.CHOC2(P1) ESC.CHOC1(P0) ESC.CHOC2(P1) F1.CHOC1(P0) F1.CHOC2(P1) F2.CHOC1(P0) F2.CHOC2(P1) F3.CHOC1(P0) F3.CHOC2(P1) F4.CHOC1(P0) F4.CHOC2(P1) F5.CHOC1(P0) F5.CHOC2(P1) F6.CHOC1(P0) F6.CHOC2(P1) F7.CHOC1(P0) F7.CHOC2(P1) F8.CHOC1(P0) F8.CHOC2(P1) F9.CHOC1(P0) F9.CHOC2(P1) F10.CHOC1(P0) F10.CHOC2(P1) F11.CHOC1(P0) F11.CHOC2(P1) F12.CHOC1(P0) F12.CHOC2(P1) F.CHOC1(P0) F.CHOC2(P1) FN.P$1 FN.P$2 FOLDER.CHOC1(P0) FOLDER.CHOC2(P1) G.CHOC1(P0) G.CHOC2(P1) GREATER-THAN.CHOC1(P0) GREATER-THAN.CHOC2(P1) GREEN_ROTENC.A GREEN_ROTENC.B GREEN_ROTENC.C GREEN_ROTENC.SW+ GREEN_ROTENC.SW- H.CHOC1(P0) H.CHOC2(P1) HIBERNATE.CHOC1(P0) HIBERNATE.CHOC2(P1) HOME.CHOC1(P0) HOME.CHOC2(P1) I.CHOC1(P0) I.CHOC2(P1) INSERT.CHOC1(P0) INSERT.CHOC2(P1) J.CHOC1(P0) J.CHOC2(P1) K.CHOC1(P0) K.CHOC2(P1) KVM_PC1.CHOC1(P0) KVM_PC1.CHOC2(P1) KVM_PC2.CHOC1(P0) KVM_PC2.CHOC2(P1) KVM_PC3.CHOC1(P0) KVM_PC3.CHOC2(P1) KVM_PC4.CHOC1(P0) KVM_PC4.CHOC2(P1) L.CHOC1(P0) L.CHOC2(P1) LCD-BUTTON-BOTTOM.P$1 LCD-BUTTON-BOTTOM.P$2 LCD-BUTTON-TOP.P$1 LCD-BUTTON-TOP.P$2 LEFT-ALT.CHOC1(P0) LEFT-ALT.CHOC2(P1) LEFT-CTRL.CHOC1(P0) LEFT-CTRL.CHOC2(P1) LEFT-SUPER.CHOC1(P0) LEFT-SUPER.CHOC2(P1) LEFT.CHOC1(P0) LEFT.CHOC2(P1) LESS-THAN.CHOC1(P0) LESS-THAN.CHOC2(P1) LSHIFT.CHOC1(P0) LSHIFT.CHOC2(P1) M.CHOC1(P0) M.CHOC2(P1) MENU.CHOC1(P0) MENU.CHOC2(P1) MUTE.CHOC1(P0) MUTE.CHOC2(P1) N.CHOC1(P0) N.CHOC2(P1) NEXT.CHOC1(P0) NEXT.CHOC2(P1) NOTES.CHOC1(P0) NOTES.CHOC2(P1) NUM0.CHOC1(P0) NUM0.CHOC2(P1) NUM1.CHOC1(P0) NUM1.CHOC2(P1) NUM2.CHOC1(P0) NUM2.CHOC2(P1) NUM3.CHOC1(P0) NUM3.CHOC2(P1) NUM4.CHOC1(P0) NUM4.CHOC2(P1) NUM5.CHOC1(P0) NUM5.CHOC2(P1) NUM6.CHOC1(P0) NUM6.CHOC2(P1) NUM7.CHOC1(P0) NUM7.CHOC2(P1) NUM8.CHOC1(P0) NUM8.CHOC2(P1) NUM9.CHOC1(P0) NUM9.CHOC2(P1) NUM-LOCK.CHOC1(P0) NUM-LOCK.CHOC2(P1) NUM-MINUS.CHOC1(P0) NUM-MINUS.CHOC2(P1) NUM-PLUS.CHOC1(P0) NUM-PLUS.CHOC2(P1) O.CHOC1(P0) O.CHOC2(P1) P.CHOC1(P0) P.CHOC2(P1) PAD0.CHOC1(P0) PAD0.CHOC2(P1) PAD1.CHOC1(P0) PAD1.CHOC2(P1) PAD2.CHOC1(P0) PAD2.CHOC2(P1) PAD3.CHOC1(P0) PAD3.CHOC2(P1) PAD4.CHOC1(P0) PAD4.CHOC2(P1) PAD5.CHOC1(P0) PAD5.CHOC2(P1) PAD6.CHOC1(P0) PAD6.CHOC2(P1) PAD7.CHOC1(P0) PAD7.CHOC2(P1) PAD8.CHOC1(P0) PAD8.CHOC2(P1) PAD9.CHOC1(P0) PAD9.CHOC2(P1) PAD-ASTERISK.CHOC1(P0) PAD-ASTERISK.CHOC2(P1) PAD-ENTER.CHOC1(P0) PAD-ENTER.CHOC2(P1) PAD-MINUS.CHOC1(P0) PAD-MINUS.CHOC2(P1) PAD-PERIOD.CHOC1(P0) PAD-PERIOD.CHOC2(P1) PAD-PLUS.CHOC1(P0) PAD-PLUS.CHOC2(P1) PAD-SLASH.CHOC1(P0) PAD-SLASH.CHOC2(P1) PAGE-DOWN.CHOC1(P0) PAGE-DOWN.CHOC2(P1) PAGE-UP.CHOC1(P0) PAGE-UP.CHOC2(P1) PLAY-PAUSE.CHOC1(P0) PLAY-PAUSE.CHOC2(P1) PRESENT.CHOC1(P0) PRESENT.CHOC2(P1) PREVIOUS.CHOC1(P0) PREVIOUS.CHOC2(P1) PRINT-SCREEN.CHOC1(P0) PRINT-SCREEN.CHOC2(P1) Q.CHOC1(P0) Q.CHOC2(P1) QUESTION-MARK.CHOC1(P0) QUESTION-MARK.CHOC2(P1) QUOTATION-MARK.CHOC1(P0) QUOTATION-MARK.CHOC2(P1) R.CHOC1(P0) R.CHOC2(P1) RECORD.CHOC1(P0) RECORD.CHOC2(P1) RED_ROTENC.A RED_ROTENC.B RED_ROTENC.C RED_ROTENC.SW+ RED_ROTENC.SW- RES-ABOVE-F10.CHOC1(P0) RES-ABOVE-F10.CHOC2(P1) RES-BY-ESC.CHOC1(P0) RES-BY-ESC.CHOC2(P1) RES-DELETE.P$1 RES-DELETE.P$2 RES-END.P$1 RES-END.P$2 RES-LEFT.P$1 RES-LEFT.P$2 RES-PGDN.P$1 RES-PGDN.P$2 RES-RIGHT.P$1 RES-RIGHT.P$2 RGB_A.1(GRN-A) RGB_A.2(RED-A) RGB_A.3(BLU-A) RGB_A.4(BLU-C) RGB_A.5(RED-C) RGB_A.6(GRN-C) RGB_B.1(GRN-A) RGB_B.2(RED-A) RGB_B.3(BLU-A) RGB_B.4(BLU-C) RGB_B.5(RED-C) RGB_B.6(GRN-C) RGB_BACKSLASH.1(GRN-A) RGB_BACKSLASH.2(RED-A) RGB_BACKSLASH.3(BLU-A) RGB_BACKSLASH.4(BLU-C) RGB_BACKSLASH.5(RED-C) RGB_BACKSLASH.6(GRN-C) RGB_BACKSPACE.1(GRN-A) RGB_BACKSPACE.2(RED-A) RGB_BACKSPACE.3(BLU-A) RGB_BACKSPACE.4(BLU-C) RGB_BACKSPACE.5(RED-C) RGB_BACKSPACE.6(GRN-C) RGB_BLUE-ROTENC.1(GRN-A) RGB_BLUE-ROTENC.2(RED-A) RGB_BLUE-ROTENC.3(BLU-A) RGB_BLUE-ROTENC.4(BLU-C) RGB_BLUE-ROTENC.5(RED-C) RGB_BLUE-ROTENC.6(GRN-C) RGB_BRACE-CLOSING.1(GRN-A) RGB_BRACE-CLOSING.2(RED-A) RGB_BRACE-CLOSING.3(BLU-A) RGB_BRACE-CLOSING.4(BLU-C) RGB_BRACE-CLOSING.5(RED-C) RGB_BRACE-CLOSING.6(GRN-C) RGB_BRACE-OPENING.1(GRN-A) RGB_BRACE-OPENING.2(RED-A) RGB_BRACE-OPENING.3(BLU-A) RGB_BRACE-OPENING.4(BLU-C) RGB_BRACE-OPENING.5(RED-C) RGB_BRACE-OPENING.6(GRN-C) RGB_BRIGHTNESS-MINUS.1(GRN-A) RGB_BRIGHTNESS-MINUS.2(RED-A) RGB_BRIGHTNESS-MINUS.3(BLU-A) RGB_BRIGHTNESS-MINUS.4(BLU-C) RGB_BRIGHTNESS-MINUS.5(RED-C) RGB_BRIGHTNESS-MINUS.6(GRN-C) RGB_BRIGHTNESS-PLUS.1(GRN-A) RGB_BRIGHTNESS-PLUS.2(RED-A) RGB_BRIGHTNESS-PLUS.3(BLU-A) RGB_BRIGHTNESS-PLUS.4(BLU-C) RGB_BRIGHTNESS-PLUS.5(RED-C) RGB_BRIGHTNESS-PLUS.6(GRN-C) RGB_BRIGHTNESS.1(GRN-A) RGB_BRIGHTNESS.2(RED-A) RGB_BRIGHTNESS.3(BLU-A) RGB_BRIGHTNESS.4(BLU-C) RGB_BRIGHTNESS.5(RED-C) RGB_BRIGHTNESS.6(GRN-C) RGB_C.1(GRN-A) RGB_C.2(RED-A) RGB_C.3(BLU-A) RGB_C.4(BLU-C) RGB_C.5(RED-C) RGB_C.6(GRN-C) RGB_CALC.1(GRN-A) RGB_CALC.2(RED-A) RGB_CALC.3(BLU-A) RGB_CALC.4(BLU-C) RGB_CALC.5(RED-C) RGB_CALC.6(GRN-C) RGB_CAPS-LOCK.1(GRN-A) RGB_CAPS-LOCK.2(RED-A) RGB_CAPS-LOCK.3(BLU-A) RGB_CAPS-LOCK.4(BLU-C) RGB_CAPS-LOCK.5(RED-C) RGB_CAPS-LOCK.6(GRN-C) RGB_COLON.1(GRN-A) RGB_COLON.2(RED-A) RGB_COLON.3(BLU-A) RGB_COLON.4(BLU-C) RGB_COLON.5(RED-C) RGB_COLON.6(GRN-C) RGB_D.1(GRN-A) RGB_D.2(RED-A) RGB_D.3(BLU-A) RGB_D.4(BLU-C) RGB_D.5(RED-C) RGB_D.6(GRN-C) RGB_DELETE.1(GRN-A) RGB_DELETE.2(RED-A) RGB_DELETE.3(BLU-A) RGB_DELETE.4(BLU-C) RGB_DELETE.5(RED-C) RGB_DELETE.6(GRN-C) RGB_DOWN.1(GRN-A) RGB_DOWN.2(RED-A) RGB_DOWN.3(BLU-A) RGB_DOWN.4(BLU-C) RGB_DOWN.5(RED-C) RGB_DOWN.6(GRN-C) RGB_E.1(GRN-A) RGB_E.2(RED-A) RGB_E.3(BLU-A) RGB_E.4(BLU-C) RGB_E.5(RED-C) RGB_E.6(GRN-C) RGB_END.1(GRN-A) RGB_END.2(RED-A) RGB_END.3(BLU-A) RGB_END.4(BLU-C) RGB_END.5(RED-C) RGB_END.6(GRN-C) RGB_ENTER.1(GRN-A) RGB_ENTER.2(RED-A) RGB_ENTER.3(BLU-A) RGB_ENTER.4(BLU-C) RGB_ENTER.5(RED-C) RGB_ENTER.6(GRN-C) RGB_ESC.1(GRN-A) RGB_ESC.2(RED-A) RGB_ESC.3(BLU-A) RGB_ESC.4(BLU-C) RGB_ESC.5(RED-C) RGB_ESC.6(GRN-C) RGB_F1.1(GRN-A) RGB_F1.2(RED-A) RGB_F1.3(BLU-A) RGB_F1.4(BLU-C) RGB_F1.5(RED-C) RGB_F1.6(GRN-C) RGB_F2.1(GRN-A) RGB_F2.2(RED-A) RGB_F2.3(BLU-A) RGB_F2.4(BLU-C) RGB_F2.5(RED-C) RGB_F2.6(GRN-C) RGB_F3.1(GRN-A) RGB_F3.2(RED-A) RGB_F3.3(BLU-A) RGB_F3.4(BLU-C) RGB_F3.5(RED-C) RGB_F3.6(GRN-C) RGB_F4.1(GRN-A) RGB_F4.2(RED-A) RGB_F4.3(BLU-A) RGB_F4.4(BLU-C) RGB_F4.5(RED-C) RGB_F4.6(GRN-C) RGB_F5.1(GRN-A) RGB_F5.2(RED-A) RGB_F5.3(BLU-A) RGB_F5.4(BLU-C) RGB_F5.5(RED-C) RGB_F5.6(GRN-C) RGB_F6.1(GRN-A) RGB_F6.2(RED-A) RGB_F6.3(BLU-A) RGB_F6.4(BLU-C) RGB_F6.5(RED-C) RGB_F6.6(GRN-C) RGB_F7.1(GRN-A) RGB_F7.2(RED-A) RGB_F7.3(BLU-A) RGB_F7.4(BLU-C) RGB_F7.5(RED-C) RGB_F7.6(GRN-C) RGB_F8.1(GRN-A) RGB_F8.2(RED-A) RGB_F8.3(BLU-A) RGB_F8.4(BLU-C) RGB_F8.5(RED-C) RGB_F8.6(GRN-C) RGB_F9.1(GRN-A) RGB_F9.2(RED-A) RGB_F9.3(BLU-A) RGB_F9.4(BLU-C) RGB_F9.5(RED-C) RGB_F9.6(GRN-C) RGB_F10.1(GRN-A) RGB_F10.2(RED-A) RGB_F10.3(BLU-A) RGB_F10.4(BLU-C) RGB_F10.5(RED-C) RGB_F10.6(GRN-C) RGB_F11.1(GRN-A) RGB_F11.2(RED-A) RGB_F11.3(BLU-A) RGB_F11.4(BLU-C) RGB_F11.5(RED-C) RGB_F11.6(GRN-C) RGB_F12.1(GRN-A) RGB_F12.2(RED-A) RGB_F12.3(BLU-A) RGB_F12.4(BLU-C) RGB_F12.5(RED-C) RGB_F12.6(GRN-C) RGB_F.1(GRN-A) RGB_F.2(RED-A) RGB_F.3(BLU-A) RGB_F.4(BLU-C) RGB_F.5(RED-C) RGB_F.6(GRN-C) RGB_FN.1(GRN-A) RGB_FN.2(RED-A) RGB_FN.3(BLU-A) RGB_FN.4(BLU-C) RGB_FN.5(RED-C) RGB_FN.6(GRN-C) RGB_FOLDER.1(GRN-A) RGB_FOLDER.2(RED-A) RGB_FOLDER.3(BLU-A) RGB_FOLDER.4(BLU-C) RGB_FOLDER.5(RED-C) RGB_FOLDER.6(GRN-C) RGB_G.1(GRN-A) RGB_G.2(RED-A) RGB_G.3(BLU-A) RGB_G.4(BLU-C) RGB_G.5(RED-C) RGB_G.6(GRN-C) RGB_GREATER-THAN.1(GRN-A) RGB_GREATER-THAN.2(RED-A) RGB_GREATER-THAN.3(BLU-A) RGB_GREATER-THAN.4(BLU-C) RGB_GREATER-THAN.5(RED-C) RGB_GREATER-THAN.6(GRN-C) RGB_GREEN-ROTENC.1(GRN-A) RGB_GREEN-ROTENC.2(RED-A) RGB_GREEN-ROTENC.3(BLU-A) RGB_GREEN-ROTENC.4(BLU-C) RGB_GREEN-ROTENC.5(RED-C) RGB_GREEN-ROTENC.6(GRN-C) RGB_H.1(GRN-A) RGB_H.2(RED-A) RGB_H.3(BLU-A) RGB_H.4(BLU-C) RGB_H.5(RED-C) RGB_H.6(GRN-C) RGB_HIBERNATE.1(GRN-A) RGB_HIBERNATE.2(RED-A) RGB_HIBERNATE.3(BLU-A) RGB_HIBERNATE.4(BLU-C) RGB_HIBERNATE.5(RED-C) RGB_HIBERNATE.6(GRN-C) RGB_HOME.1(GRN-A) RGB_HOME.2(RED-A) RGB_HOME.3(BLU-A) RGB_HOME.4(BLU-C) RGB_HOME.5(RED-C) RGB_HOME.6(GRN-C) RGB_I.1(GRN-A) RGB_I.2(RED-A) RGB_I.3(BLU-A) RGB_I.4(BLU-C) RGB_I.5(RED-C) RGB_I.6(GRN-C) RGB_INSERT.1(GRN-A) RGB_INSERT.2(RED-A) RGB_INSERT.3(BLU-A) RGB_INSERT.4(BLU-C) RGB_INSERT.5(RED-C) RGB_INSERT.6(GRN-C) RGB_J.1(GRN-A) RGB_J.2(RED-A) RGB_J.3(BLU-A) RGB_J.4(BLU-C) RGB_J.5(RED-C) RGB_J.6(GRN-C) RGB_K.1(GRN-A) RGB_K.2(RED-A) RGB_K.3(BLU-A) RGB_K.4(BLU-C) RGB_K.5(RED-C) RGB_K.6(GRN-C) RGB_KVM-PC1.1(GRN-A) RGB_KVM-PC1.2(RED-A) RGB_KVM-PC1.3(BLU-A) RGB_KVM-PC1.4(BLU-C) RGB_KVM-PC1.5(RED-C) RGB_KVM-PC1.6(GRN-C) RGB_KVM-PC2.1(GRN-A) RGB_KVM-PC2.2(RED-A) RGB_KVM-PC2.3(BLU-A) RGB_KVM-PC2.4(BLU-C) RGB_KVM-PC2.5(RED-C) RGB_KVM-PC2.6(GRN-C) RGB_KVM-PC3.1(GRN-A) RGB_KVM-PC3.2(RED-A) RGB_KVM-PC3.3(BLU-A) RGB_KVM-PC3.4(BLU-C) RGB_KVM-PC3.5(RED-C) RGB_KVM-PC3.6(GRN-C) RGB_KVM-PC4.1(GRN-A) RGB_KVM-PC4.2(RED-A) RGB_KVM-PC4.3(BLU-A) RGB_KVM-PC4.4(BLU-C) RGB_KVM-PC4.5(RED-C) RGB_KVM-PC4.6(GRN-C) RGB_L.1(GRN-A) RGB_L.2(RED-A) RGB_L.3(BLU-A) RGB_L.4(BLU-C) RGB_L.5(RED-C) RGB_L.6(GRN-C) RGB_LCD-BUTTON-BOTTOM.1(GRN-A) RGB_LCD-BUTTON-BOTTOM.2(RED-A) RGB_LCD-BUTTON-BOTTOM.3(BLU-A) RGB_LCD-BUTTON-BOTTOM.4(BLU-C) RGB_LCD-BUTTON-BOTTOM.5(RED-C) RGB_LCD-BUTTON-BOTTOM.6(GRN-C) RGB_LCD-BUTTON-TOP.1(GRN-A) RGB_LCD-BUTTON-TOP.2(RED-A) RGB_LCD-BUTTON-TOP.3(BLU-A) RGB_LCD-BUTTON-TOP.4(BLU-C) RGB_LCD-BUTTON-TOP.5(RED-C) RGB_LCD-BUTTON-TOP.6(GRN-C) RGB_LEFT-ALT.1(GRN-A) RGB_LEFT-ALT.2(RED-A) RGB_LEFT-ALT.3(BLU-A) RGB_LEFT-ALT.4(BLU-C) RGB_LEFT-ALT.5(RED-C) RGB_LEFT-ALT.6(GRN-C) RGB_LEFT-CTRL.1(GRN-A) RGB_LEFT-CTRL.2(RED-A) RGB_LEFT-CTRL.3(BLU-A) RGB_LEFT-CTRL.4(BLU-C) RGB_LEFT-CTRL.5(RED-C) RGB_LEFT-CTRL.6(GRN-C) RGB_LEFT-SUPER.1(GRN-A) RGB_LEFT-SUPER.2(RED-A) RGB_LEFT-SUPER.3(BLU-A) RGB_LEFT-SUPER.4(BLU-C) RGB_LEFT-SUPER.5(RED-C) RGB_LEFT-SUPER.6(GRN-C) RGB_LEFT.1(GRN-A) RGB_LEFT.2(RED-A) RGB_LEFT.3(BLU-A) RGB_LEFT.4(BLU-C) RGB_LEFT.5(RED-C) RGB_LEFT.6(GRN-C) RGB_LESS-THAN.1(GRN-A) RGB_LESS-THAN.2(RED-A) RGB_LESS-THAN.3(BLU-A) RGB_LESS-THAN.4(BLU-C) RGB_LESS-THAN.5(RED-C) RGB_LESS-THAN.6(GRN-C) RGB_LSHIFT.1(GRN-A) RGB_LSHIFT.2(RED-A) RGB_LSHIFT.3(BLU-A) RGB_LSHIFT.4(BLU-C) RGB_LSHIFT.5(RED-C) RGB_LSHIFT.6(GRN-C) RGB_M.1(GRN-A) RGB_M.2(RED-A) RGB_M.3(BLU-A) RGB_M.4(BLU-C) RGB_M.5(RED-C) RGB_M.6(GRN-C) RGB_MENU.1(GRN-A) RGB_MENU.2(RED-A) RGB_MENU.3(BLU-A) RGB_MENU.4(BLU-C) RGB_MENU.5(RED-C) RGB_MENU.6(GRN-C) RGB_MUTE.1(GRN-A) RGB_MUTE.2(RED-A) RGB_MUTE.3(BLU-A) RGB_MUTE.4(BLU-C) RGB_MUTE.5(RED-C) RGB_MUTE.6(GRN-C) RGB_N.1(GRN-A) RGB_N.2(RED-A) RGB_N.3(BLU-A) RGB_N.4(BLU-C) RGB_N.5(RED-C) RGB_N.6(GRN-C) RGB_NEXT.1(GRN-A) RGB_NEXT.2(RED-A) RGB_NEXT.3(BLU-A) RGB_NEXT.4(BLU-C) RGB_NEXT.5(RED-C) RGB_NEXT.6(GRN-C) RGB_NOTES.1(GRN-A) RGB_NOTES.2(RED-A) RGB_NOTES.3(BLU-A) RGB_NOTES.4(BLU-C) RGB_NOTES.5(RED-C) RGB_NOTES.6(GRN-C) RGB_NUM0.1(GRN-A) RGB_NUM0.2(RED-A) RGB_NUM0.3(BLU-A) RGB_NUM0.4(BLU-C) RGB_NUM0.5(RED-C) RGB_NUM0.6(GRN-C) RGB_NUM1.1(GRN-A) RGB_NUM1.2(RED-A) RGB_NUM1.3(BLU-A) RGB_NUM1.4(BLU-C) RGB_NUM1.5(RED-C) RGB_NUM1.6(GRN-C) RGB_NUM2.1(GRN-A) RGB_NUM2.2(RED-A) RGB_NUM2.3(BLU-A) RGB_NUM2.4(BLU-C) RGB_NUM2.5(RED-C) RGB_NUM2.6(GRN-C) RGB_NUM3.1(GRN-A) RGB_NUM3.2(RED-A) RGB_NUM3.3(BLU-A) RGB_NUM3.4(BLU-C) RGB_NUM3.5(RED-C) RGB_NUM3.6(GRN-C) RGB_NUM4.1(GRN-A) RGB_NUM4.2(RED-A) RGB_NUM4.3(BLU-A) RGB_NUM4.4(BLU-C) RGB_NUM4.5(RED-C) RGB_NUM4.6(GRN-C) RGB_NUM5.1(GRN-A) RGB_NUM5.2(RED-A) RGB_NUM5.3(BLU-A) RGB_NUM5.4(BLU-C) RGB_NUM5.5(RED-C) RGB_NUM5.6(GRN-C) RGB_NUM6.1(GRN-A) RGB_NUM6.2(RED-A) RGB_NUM6.3(BLU-A) RGB_NUM6.4(BLU-C) RGB_NUM6.5(RED-C) RGB_NUM6.6(GRN-C) RGB_NUM7.1(GRN-A) RGB_NUM7.2(RED-A) RGB_NUM7.3(BLU-A) RGB_NUM7.4(BLU-C) RGB_NUM7.5(RED-C) RGB_NUM7.6(GRN-C) RGB_NUM8.1(GRN-A) RGB_NUM8.2(RED-A) RGB_NUM8.3(BLU-A) RGB_NUM8.4(BLU-C) RGB_NUM8.5(RED-C) RGB_NUM8.6(GRN-C) RGB_NUM9.1(GRN-A) RGB_NUM9.2(RED-A) RGB_NUM9.3(BLU-A) RGB_NUM9.4(BLU-C) RGB_NUM9.5(RED-C) RGB_NUM9.6(GRN-C) RGB_NUM-LOCK.1(GRN-A) RGB_NUM-LOCK.2(RED-A) RGB_NUM-LOCK.3(BLU-A) RGB_NUM-LOCK.4(BLU-C) RGB_NUM-LOCK.5(RED-C) RGB_NUM-LOCK.6(GRN-C) RGB_NUM-MINUS.1(GRN-A) RGB_NUM-MINUS.2(RED-A) RGB_NUM-MINUS.3(BLU-A) RGB_NUM-MINUS.4(BLU-C) RGB_NUM-MINUS.5(RED-C) RGB_NUM-MINUS.6(GRN-C) RGB_NUM-PLUS.1(GRN-A) RGB_NUM-PLUS.2(RED-A) RGB_NUM-PLUS.3(BLU-A) RGB_NUM-PLUS.4(BLU-C) RGB_NUM-PLUS.5(RED-C) RGB_NUM-PLUS.6(GRN-C) RGB_O.1(GRN-A) RGB_O.2(RED-A) RGB_O.3(BLU-A) RGB_O.4(BLU-C) RGB_O.5(RED-C) RGB_O.6(GRN-C) RGB_P.1(GRN-A) RGB_P.2(RED-A) RGB_P.3(BLU-A) RGB_P.4(BLU-C) RGB_P.5(RED-C) RGB_P.6(GRN-C) RGB_PAD0.1(GRN-A) RGB_PAD0.2(RED-A) RGB_PAD0.3(BLU-A) RGB_PAD0.4(BLU-C) RGB_PAD0.5(RED-C) RGB_PAD0.6(GRN-C) RGB_PAD1.1(GRN-A) RGB_PAD1.2(RED-A) RGB_PAD1.3(BLU-A) RGB_PAD1.4(BLU-C) RGB_PAD1.5(RED-C) RGB_PAD1.6(GRN-C) RGB_PAD2.1(GRN-A) RGB_PAD2.2(RED-A) RGB_PAD2.3(BLU-A) RGB_PAD2.4(BLU-C) RGB_PAD2.5(RED-C) RGB_PAD2.6(GRN-C) RGB_PAD3.1(GRN-A) RGB_PAD3.2(RED-A) RGB_PAD3.3(BLU-A) RGB_PAD3.4(BLU-C) RGB_PAD3.5(RED-C) RGB_PAD3.6(GRN-C) RGB_PAD4.1(GRN-A) RGB_PAD4.2(RED-A) RGB_PAD4.3(BLU-A) RGB_PAD4.4(BLU-C) RGB_PAD4.5(RED-C) RGB_PAD4.6(GRN-C) RGB_PAD5.1(GRN-A) RGB_PAD5.2(RED-A) RGB_PAD5.3(BLU-A) RGB_PAD5.4(BLU-C) RGB_PAD5.5(RED-C) RGB_PAD5.6(GRN-C) RGB_PAD6.1(GRN-A) RGB_PAD6.2(RED-A) RGB_PAD6.3(BLU-A) RGB_PAD6.4(BLU-C) RGB_PAD6.5(RED-C) RGB_PAD6.6(GRN-C) RGB_PAD7.1(GRN-A) RGB_PAD7.2(RED-A) RGB_PAD7.3(BLU-A) RGB_PAD7.4(BLU-C) RGB_PAD7.5(RED-C) RGB_PAD7.6(GRN-C) RGB_PAD8.1(GRN-A) RGB_PAD8.2(RED-A) RGB_PAD8.3(BLU-A) RGB_PAD8.4(BLU-C) RGB_PAD8.5(RED-C) RGB_PAD8.6(GRN-C) RGB_PAD9.1(GRN-A) RGB_PAD9.2(RED-A) RGB_PAD9.3(BLU-A) RGB_PAD9.4(BLU-C) RGB_PAD9.5(RED-C) RGB_PAD9.6(GRN-C) RGB_PAD-ASTERISK.1(GRN-A) RGB_PAD-ASTERISK.2(RED-A) RGB_PAD-ASTERISK.3(BLU-A) RGB_PAD-ASTERISK.4(BLU-C) RGB_PAD-ASTERISK.5(RED-C) RGB_PAD-ASTERISK.6(GRN-C) RGB_PAD-ENTER.1(GRN-A) RGB_PAD-ENTER.2(RED-A) RGB_PAD-ENTER.3(BLU-A) RGB_PAD-ENTER.4(BLU-C) RGB_PAD-ENTER.5(RED-C) RGB_PAD-ENTER.6(GRN-C) RGB_PAD-MINUS.1(GRN-A) RGB_PAD-MINUS.2(RED-A) RGB_PAD-MINUS.3(BLU-A) RGB_PAD-MINUS.4(BLU-C) RGB_PAD-MINUS.5(RED-C) RGB_PAD-MINUS.6(GRN-C) RGB_PAD-PERIOD.1(GRN-A) RGB_PAD-PERIOD.2(RED-A) RGB_PAD-PERIOD.3(BLU-A) RGB_PAD-PERIOD.4(BLU-C) RGB_PAD-PERIOD.5(RED-C) RGB_PAD-PERIOD.6(GRN-C) RGB_PAD-PLUS.1(GRN-A) RGB_PAD-PLUS.2(RED-A) RGB_PAD-PLUS.3(BLU-A) RGB_PAD-PLUS.4(BLU-C) RGB_PAD-PLUS.5(RED-C) RGB_PAD-PLUS.6(GRN-C) RGB_PAD-SLASH.1(GRN-A) RGB_PAD-SLASH.2(RED-A) RGB_PAD-SLASH.3(BLU-A) RGB_PAD-SLASH.4(BLU-C) RGB_PAD-SLASH.5(RED-C) RGB_PAD-SLASH.6(GRN-C) RGB_PAGE-DOWN.1(GRN-A) RGB_PAGE-DOWN.2(RED-A) RGB_PAGE-DOWN.3(BLU-A) RGB_PAGE-DOWN.4(BLU-C) RGB_PAGE-DOWN.5(RED-C) RGB_PAGE-DOWN.6(GRN-C) RGB_PAGE-UP.1(GRN-A) RGB_PAGE-UP.2(RED-A) RGB_PAGE-UP.3(BLU-A) RGB_PAGE-UP.4(BLU-C) RGB_PAGE-UP.5(RED-C) RGB_PAGE-UP.6(GRN-C) RGB_PLAY-PAUSE.1(GRN-A) RGB_PLAY-PAUSE.2(RED-A) RGB_PLAY-PAUSE.3(BLU-A) RGB_PLAY-PAUSE.4(BLU-C) RGB_PLAY-PAUSE.5(RED-C) RGB_PLAY-PAUSE.6(GRN-C) RGB_PRESENT.1(GRN-A) RGB_PRESENT.2(RED-A) RGB_PRESENT.3(BLU-A) RGB_PRESENT.4(BLU-C) RGB_PRESENT.5(RED-C) RGB_PRESENT.6(GRN-C) RGB_PREVIOUS.1(GRN-A) RGB_PREVIOUS.2(RED-A) RGB_PREVIOUS.3(BLU-A) RGB_PREVIOUS.4(BLU-C) RGB_PREVIOUS.5(RED-C) RGB_PREVIOUS.6(GRN-C) RGB_PRINT-SCREEN.1(GRN-A) RGB_PRINT-SCREEN.2(RED-A) RGB_PRINT-SCREEN.3(BLU-A) RGB_PRINT-SCREEN.4(BLU-C) RGB_PRINT-SCREEN.5(RED-C) RGB_PRINT-SCREEN.6(GRN-C) RGB_Q.1(GRN-A) RGB_Q.2(RED-A) RGB_Q.3(BLU-A) RGB_Q.4(BLU-C) RGB_Q.5(RED-C) RGB_Q.6(GRN-C) RGB_QUESTION-MARK.1(GRN-A) RGB_QUESTION-MARK.2(RED-A) RGB_QUESTION-MARK.3(BLU-A) RGB_QUESTION-MARK.4(BLU-C) RGB_QUESTION-MARK.5(RED-C) RGB_QUESTION-MARK.6(GRN-C) RGB_QUOTATION-MARK.1(GRN-A) RGB_QUOTATION-MARK.2(RED-A) RGB_QUOTATION-MARK.3(BLU-A) RGB_QUOTATION-MARK.4(BLU-C) RGB_QUOTATION-MARK.5(RED-C) RGB_QUOTATION-MARK.6(GRN-C) RGB_R.1(GRN-A) RGB_R.2(RED-A) RGB_R.3(BLU-A) RGB_R.4(BLU-C) RGB_R.5(RED-C) RGB_R.6(GRN-C) RGB_RECORD.1(GRN-A) RGB_RECORD.2(RED-A) RGB_RECORD.3(BLU-A) RGB_RECORD.4(BLU-C) RGB_RECORD.5(RED-C) RGB_RECORD.6(GRN-C) RGB_RED-ROTENC.1(GRN-A) RGB_RED-ROTENC.2(RED-A) RGB_RED-ROTENC.3(BLU-A) RGB_RED-ROTENC.4(BLU-C) RGB_RED-ROTENC.5(RED-C) RGB_RED-ROTENC.6(GRN-C) RGB_RES-ABOVE-F10.1(GRN-A) RGB_RES-ABOVE-F10.2(RED-A) RGB_RES-ABOVE-F10.3(BLU-A) RGB_RES-ABOVE-F10.4(BLU-C) RGB_RES-ABOVE-F10.5(RED-C) RGB_RES-ABOVE-F10.6(GRN-C) RGB_RES-BY-ESC.1(GRN-A) RGB_RES-BY-ESC.2(RED-A) RGB_RES-BY-ESC.3(BLU-A) RGB_RES-BY-ESC.4(BLU-C) RGB_RES-BY-ESC.5(RED-C) RGB_RES-BY-ESC.6(GRN-C) RGB_RES-DELETE.1(GRN-A) RGB_RES-DELETE.2(RED-A) RGB_RES-DELETE.3(BLU-A) RGB_RES-DELETE.4(BLU-C) RGB_RES-DELETE.5(RED-C) RGB_RES-DELETE.6(GRN-C) RGB_RES-END.1(GRN-A) RGB_RES-END.2(RED-A) RGB_RES-END.3(BLU-A) RGB_RES-END.4(BLU-C) RGB_RES-END.5(RED-C) RGB_RES-END.6(GRN-C) RGB_RES-LEFT.1(GRN-A) RGB_RES-LEFT.2(RED-A) RGB_RES-LEFT.3(BLU-A) RGB_RES-LEFT.4(BLU-C) RGB_RES-LEFT.5(RED-C) RGB_RES-LEFT.6(GRN-C) RGB_RES-PGDN.1(GRN-A) RGB_RES-PGDN.2(RED-A) RGB_RES-PGDN.3(BLU-A) RGB_RES-PGDN.4(BLU-C) RGB_RES-PGDN.5(RED-C) RGB_RES-PGDN.6(GRN-C) RGB_RES-RIGHT.1(GRN-A) RGB_RES-RIGHT.2(RED-A) RGB_RES-RIGHT.3(BLU-A) RGB_RES-RIGHT.4(BLU-C) RGB_RES-RIGHT.5(RED-C) RGB_RES-RIGHT.6(GRN-C) RGB_RIGHT-ALT.1(GRN-A) RGB_RIGHT-ALT.2(RED-A) RGB_RIGHT-ALT.3(BLU-A) RGB_RIGHT-ALT.4(BLU-C) RGB_RIGHT-ALT.5(RED-C) RGB_RIGHT-ALT.6(GRN-C) RGB_RIGHT-CTRL.1(GRN-A) RGB_RIGHT-CTRL.2(RED-A) RGB_RIGHT-CTRL.3(BLU-A) RGB_RIGHT-CTRL.4(BLU-C) RGB_RIGHT-CTRL.5(RED-C) RGB_RIGHT-CTRL.6(GRN-C) RGB_RIGHT-SUPER.1(GRN-A) RGB_RIGHT-SUPER.2(RED-A) RGB_RIGHT-SUPER.3(BLU-A) RGB_RIGHT-SUPER.4(BLU-C) RGB_RIGHT-SUPER.5(RED-C) RGB_RIGHT-SUPER.6(GRN-C) RGB_RIGHT.1(GRN-A) RGB_RIGHT.2(RED-A) RGB_RIGHT.3(BLU-A) RGB_RIGHT.4(BLU-C) RGB_RIGHT.5(RED-C) RGB_RIGHT.6(GRN-C) RGB_RSHIFT.1(GRN-A) RGB_RSHIFT.2(RED-A) RGB_RSHIFT.3(BLU-A) RGB_RSHIFT.4(BLU-C) RGB_RSHIFT.5(RED-C) RGB_RSHIFT.6(GRN-C) RGB_S.1(GRN-A) RGB_S.2(RED-A) RGB_S.3(BLU-A) RGB_S.4(BLU-C) RGB_S.5(RED-C) RGB_S.6(GRN-C) RGB_SAVE-CLIP.1(GRN-A) RGB_SAVE-CLIP.2(RED-A) RGB_SAVE-CLIP.3(BLU-A) RGB_SAVE-CLIP.4(BLU-C) RGB_SAVE-CLIP.5(RED-C) RGB_SAVE-CLIP.6(GRN-C) RGB_SKIP-BACK.1(GRN-A) RGB_SKIP-BACK.2(RED-A) RGB_SKIP-BACK.3(BLU-A) RGB_SKIP-BACK.4(BLU-C) RGB_SKIP-BACK.5(RED-C) RGB_SKIP-BACK.6(GRN-C) RGB_SKIP-FORWARD.1(GRN-A) RGB_SKIP-FORWARD.2(RED-A) RGB_SKIP-FORWARD.3(BLU-A) RGB_SKIP-FORWARD.4(BLU-C) RGB_SKIP-FORWARD.5(RED-C) RGB_SKIP-FORWARD.6(GRN-C) RGB_SLEEP.1(GRN-A) RGB_SLEEP.2(RED-A) RGB_SLEEP.3(BLU-A) RGB_SLEEP.4(BLU-C) RGB_SLEEP.5(RED-C) RGB_SLEEP.6(GRN-C) RGB_SPACE.1(GRN-A) RGB_SPACE.2(RED-A) RGB_SPACE.3(BLU-A) RGB_SPACE.4(BLU-C) RGB_SPACE.5(RED-C) RGB_SPACE.6(GRN-C) RGB_STOP.1(GRN-A) RGB_STOP.2(RED-A) RGB_STOP.3(BLU-A) RGB_STOP.4(BLU-C) RGB_STOP.5(RED-C) RGB_STOP.6(GRN-C) RGB_T.1(GRN-A) RGB_T.2(RED-A) RGB_T.3(BLU-A) RGB_T.4(BLU-C) RGB_T.5(RED-C) RGB_T.6(GRN-C) RGB_TAB.1(GRN-A) RGB_TAB.2(RED-A) RGB_TAB.3(BLU-A) RGB_TAB.4(BLU-C) RGB_TAB.5(RED-C) RGB_TAB.6(GRN-C) RGB_TILDA.1(GRN-A) RGB_TILDA.2(RED-A) RGB_TILDA.3(BLU-A) RGB_TILDA.4(BLU-C) RGB_TILDA.5(RED-C) RGB_TILDA.6(GRN-C) RGB_U.1(GRN-A) RGB_U.2(RED-A) RGB_U.3(BLU-A) RGB_U.4(BLU-C) RGB_U.5(RED-C) RGB_U.6(GRN-C) RGB_UP.1(GRN-A) RGB_UP.2(RED-A) RGB_UP.3(BLU-A) RGB_UP.4(BLU-C) RGB_UP.5(RED-C) RGB_UP.6(GRN-C) RGB_V.1(GRN-A) RGB_V.2(RED-A) RGB_V.3(BLU-A) RGB_V.4(BLU-C) RGB_V.5(RED-C) RGB_V.6(GRN-C) RGB_VOLUME-MASTER.1(GRN-A) RGB_VOLUME-MASTER.2(RED-A) RGB_VOLUME-MASTER.3(BLU-A) RGB_VOLUME-MASTER.4(BLU-C) RGB_VOLUME-MASTER.5(RED-C) RGB_VOLUME-MASTER.6(GRN-C) RGB_VOLUME-PC1.1(GRN-A) RGB_VOLUME-PC1.2(RED-A) RGB_VOLUME-PC1.3(BLU-A) RGB_VOLUME-PC1.4(BLU-C) RGB_VOLUME-PC1.5(RED-C) RGB_VOLUME-PC1.6(GRN-C) RGB_VOLUME-PC2.1(GRN-A) RGB_VOLUME-PC2.2(RED-A) RGB_VOLUME-PC2.3(BLU-A) RGB_VOLUME-PC2.4(BLU-C) RGB_VOLUME-PC2.5(RED-C) RGB_VOLUME-PC2.6(GRN-C) RGB_VOLUME-PC3.1(GRN-A) RGB_VOLUME-PC3.2(RED-A) RGB_VOLUME-PC3.3(BLU-A) RGB_VOLUME-PC3.4(BLU-C) RGB_VOLUME-PC3.5(RED-C) RGB_VOLUME-PC3.6(GRN-C) RGB_VOLUME-PC4.1(GRN-A) RGB_VOLUME-PC4.2(RED-A) RGB_VOLUME-PC4.3(BLU-A) RGB_VOLUME-PC4.4(BLU-C) RGB_VOLUME-PC4.5(RED-C) RGB_VOLUME-PC4.6(GRN-C) RGB_W.1(GRN-A) RGB_W.2(RED-A) RGB_W.3(BLU-A) RGB_W.4(BLU-C) RGB_W.5(RED-C) RGB_W.6(GRN-C) RGB_X.1(GRN-A) RGB_X.2(RED-A) RGB_X.3(BLU-A) RGB_X.4(BLU-C) RGB_X.5(RED-C) RGB_X.6(GRN-C) RGB_Y.1(GRN-A) RGB_Y.2(RED-A) RGB_Y.3(BLU-A) RGB_Y.4(BLU-C) RGB_Y.5(RED-C) RGB_Y.6(GRN-C) RGB_Z.1(GRN-A) RGB_Z.2(RED-A) RGB_Z.3(BLU-A) RGB_Z.4(BLU-C) RGB_Z.5(RED-C) RGB_Z.6(GRN-C) RIGHT-ALT.CHOC1(P0) RIGHT-ALT.CHOC2(P1) RIGHT-CTRL.CHOC1(P0) RIGHT-CTRL.CHOC2(P1) RIGHT-SUPER.CHOC1(P0) RIGHT-SUPER.CHOC2(P1) RIGHT.CHOC1(P0) RIGHT.CHOC2(P1) RSHIFT.CHOC1(P0) RSHIFT.CHOC2(P1) S.CHOC1(P0) S.CHOC2(P1) SAVE_CLIP.CHOC1(P0) SAVE_CLIP.CHOC2(P1) SKIP-BACK.CHOC1(P0) SKIP-BACK.CHOC2(P1) SKIP-FORWARD.CHOC1(P0) SKIP-FORWARD.CHOC2(P1) SLEEP.CHOC1(P0) SLEEP.CHOC2(P1) SPACE.CHOC1(P0) SPACE.CHOC2(P1) STOP.CHOC1(P0) STOP.CHOC2(P1) T.CHOC1(P0) T.CHOC2(P1) TAB.CHOC1(P0) TAB.CHOC2(P1) TILDA.CHOC1(P0) TILDA.CHOC2(P1) U.CHOC1(P0) U.CHOC2(P1) UP.CHOC1(P0) UP.CHOC2(P1) V.CHOC1(P0) V.CHOC2(P1) VOLUME_MASTER.A VOLUME_MASTER.B VOLUME_MASTER.C VOLUME_MASTER.SW+ VOLUME_MASTER.SW- VOLUME_PC1.A VOLUME_PC1.B VOLUME_PC1.C VOLUME_PC1.SW+ VOLUME_PC1.SW- VOLUME_PC2.A VOLUME_PC2.B VOLUME_PC2.C VOLUME_PC2.SW+ VOLUME_PC2.SW- VOLUME_PC3.A VOLUME_PC3.B VOLUME_PC3.C VOLUME_PC3.SW+ VOLUME_PC3.SW- VOLUME_PC4.A VOLUME_PC4.B VOLUME_PC4.C VOLUME_PC4.SW+ VOLUME_PC4.SW- W.CHOC1(P0) W.CHOC2(P1) X.CHOC1(P0) X.CHOC2(P1) Y.CHOC1(P0) Y.CHOC2(P1) Z.CHOC1(P0) Z.CHOC2(P1)

## Library data of the parts
A B BACKSLASH BACKSPACE BRACE-CLOSING BRACE-OPENING BRIGHTNESS-MINUS BRIGHTNESS-PLUS C CALC CAPS-LOCK COLON D DELETE DOWN E END ENTER ESC F F1-F12 FOLDER G GREATER-THAN H HIBERNATE HOME I INSERT J K KVM_PC1-KVM_PC4 L LEFT LEFT-ALT LEFT-CTRL LEFT-SUPER LESS-THAN LSHIFT M MENU MUTE N NEXT NOTES NUM0 NUM1-NUM9 NUM-LOCK NUM-MINUS NUM-PLUS O P PAD0 PAD1-PAD9 PAD-ASTERISK PAD-ENTER PAD-MINUS PAD-PERIOD PAD-PLUS PAD-SLASH PAGE-DOWN PAGE-UP PLAY-PAUSE PRESENT PREVIOUS PRINT-SCREEN Q QUESTION-MARK QUOTATION-MARK R RECORD RES-ABOVE-F10 RES-BY-ESC RIGHT RIGHT-ALT RIGHT-CTRL RIGHT-SUPER RSHIFT S SAVE_CLIP SKIP-BACK SKIP-FORWARD SLEEP SPACE STOP T TAB TILDA U UP V W X Y Z = bak-Keyboard:KEYSWITCH-PLAIN
BLUE_ROTENC BRIGHTNESS GREEN_ROTENC RED_ROTENC VOLUME_MASTER VOLUME_PC1-VOLUME_PC4 = SparkFun-Switches:ENCODER-SWITCH: Rotary Encoder w/ Select Switch Encoders rotate similarly to potentiometers, but they’re different from potentiometers in that an encoder has full rotation without limits. They output gray code so that you can tell how much and in which direction the encoder has been turned. This encoder includes a push-down select switch built into the shaft. SparkFun Products Rotary Encoder <https://www.sparkfun.com/products/9117> (COM-09117); SF_SKU: COM-09117
FN LCD-BUTTON-BOTTOM LCD-BUTTON-TOP RES-DELETE RES-END RES-LEFT RES-PGDN RES-RIGHT = adafruit:SWITCH_PUSHBUTTON: Buttons SOFTTOUCHSMD_SJ - Soft touch temporary push button (Super Junk Akihabara) Compatible with SKPMANE010 [Mouser: 688-SKPMAN] C&K_KSS = Digikey: KSS221GLFS
RGB_A RGB_B RGB_BACKSLASH RGB_BACKSPACE RGB_BLUE-ROTENC RGB_BRACE-CLOSING RGB_BRACE-OPENING RGB_BRIGHTNESS RGB_BRIGHTNESS-MINUS RGB_BRIGHTNESS-PLUS RGB_C RGB_CALC RGB_CAPS-LOCK RGB_COLON RGB_D RGB_DELETE RGB_DOWN RGB_E RGB_END RGB_ENTER RGB_ESC RGB_F RGB_F1-RGB_F12 RGB_FN RGB_FOLDER RGB_G RGB_GREATER-THAN RGB_GREEN-ROTENC RGB_H RGB_HIBERNATE RGB_HOME RGB_I RGB_INSERT RGB_J RGB_K RGB_KVM-PC1-RGB_KVM-PC4 RGB_L RGB_LCD-BUTTON-BOTTOM RGB_LCD-BUTTON-TOP RGB_LEFT RGB_LEFT-ALT RGB_LEFT-CTRL RGB_LEFT-SUPER RGB_LESS-THAN RGB_LSHIFT RGB_M RGB_MENU RGB_MUTE RGB_N RGB_NEXT RGB_NOTES RGB_NUM0 RGB_NUM1-RGB_NUM9 RGB_NUM-LOCK RGB_NUM-MINUS RGB_NUM-PLUS RGB_O RGB_P RGB_PAD0 RGB_PAD1-RGB_PAD9 RGB_PAD-ASTERISK RGB_PAD-ENTER RGB_PAD-MINUS RGB_PAD-PERIOD RGB_PAD-PLUS RGB_PAD-SLASH RGB_PAGE-DOWN RGB_PAGE-UP RGB_PLAY-PAUSE RGB_PRESENT RGB_PREVIOUS RGB_PRINT-SCREEN RGB_Q RGB_QUESTION-MARK RGB_QUOTATION-MARK RGB_R RGB_RECORD RGB_RED-ROTENC RGB_RES-ABOVE-F10 RGB_RES-BY-ESC RGB_RES-DELETE RGB_RES-END RGB_RES-LEFT RGB_RES-PGDN RGB_RES-RIGHT RGB_RIGHT RGB_RIGHT-ALT RGB_RIGHT-CTRL RGB_RIGHT-SUPER RGB_RSHIFT RGB_S RGB_SAVE-CLIP RGB_SKIP-BACK RGB_SKIP-FORWARD RGB_SLEEP RGB_SPACE RGB_STOP RGB_T RGB_TAB RGB_TILDA RGB_U RGB_UP RGB_V RGB_VOLUME-MASTER RGB_VOLUME-PC1-RGB_VOLUME-PC4 RGB_W RGB_X RGB_Y RGB_Z = SparkFun-LED:LED-RGB: LED-RGB 6 pin RGB LED (no common connector) Packages: PLCC-6 LED-TRICOLOR-5050 - No built-in IC SparkFun Products: Digital Sandbox <https://www.sparkfun.com/products/12651> LED- SMD RGB <https://www.sparkfun.com/products/10866>; PROD_ID: DIO-10298